# EAGLE design 2016_CanSat_payload_main_final (EAGLE 7.2.0)

## Sheet 1 of 2
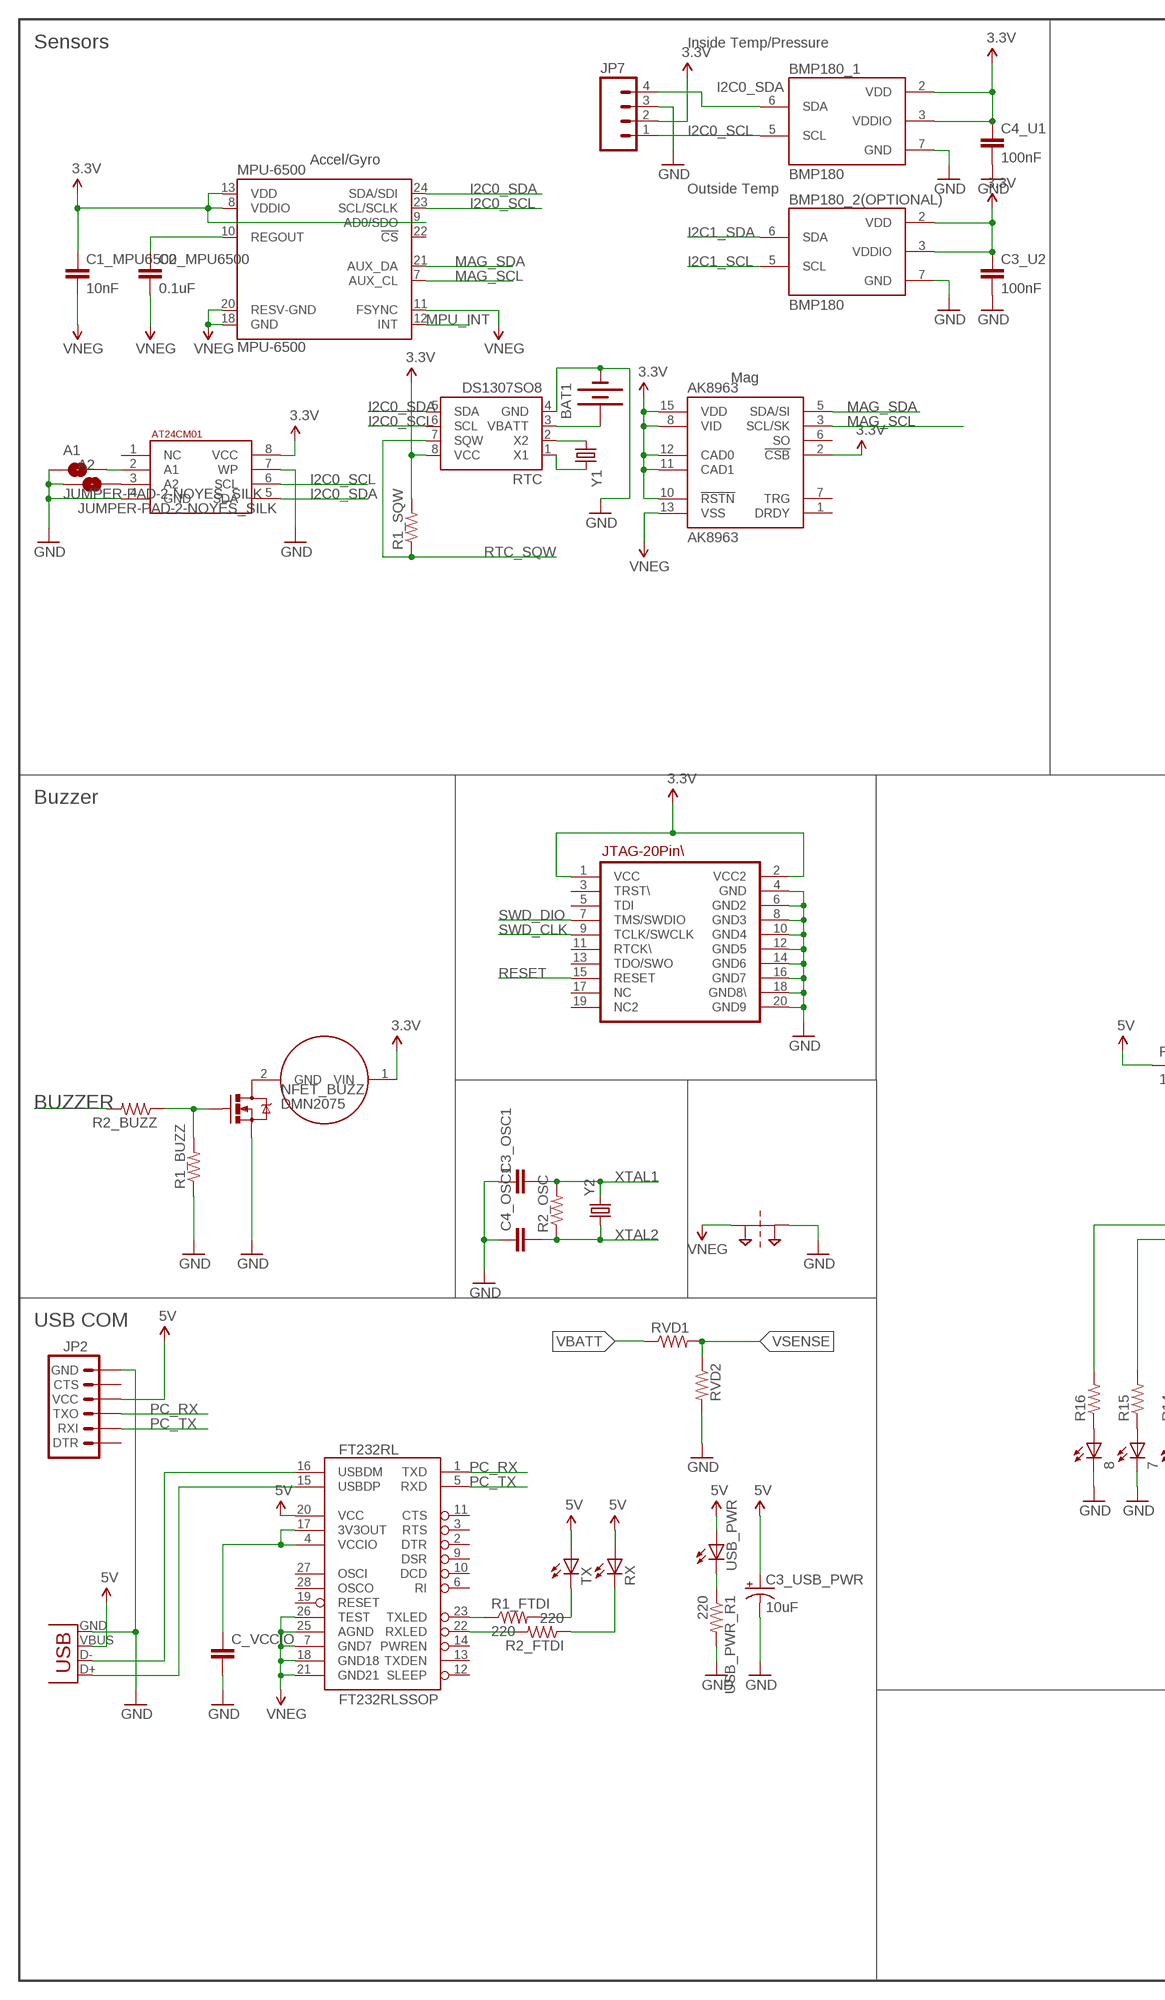
[diagram p0: schematic, sheet 1, part 1 of 2]
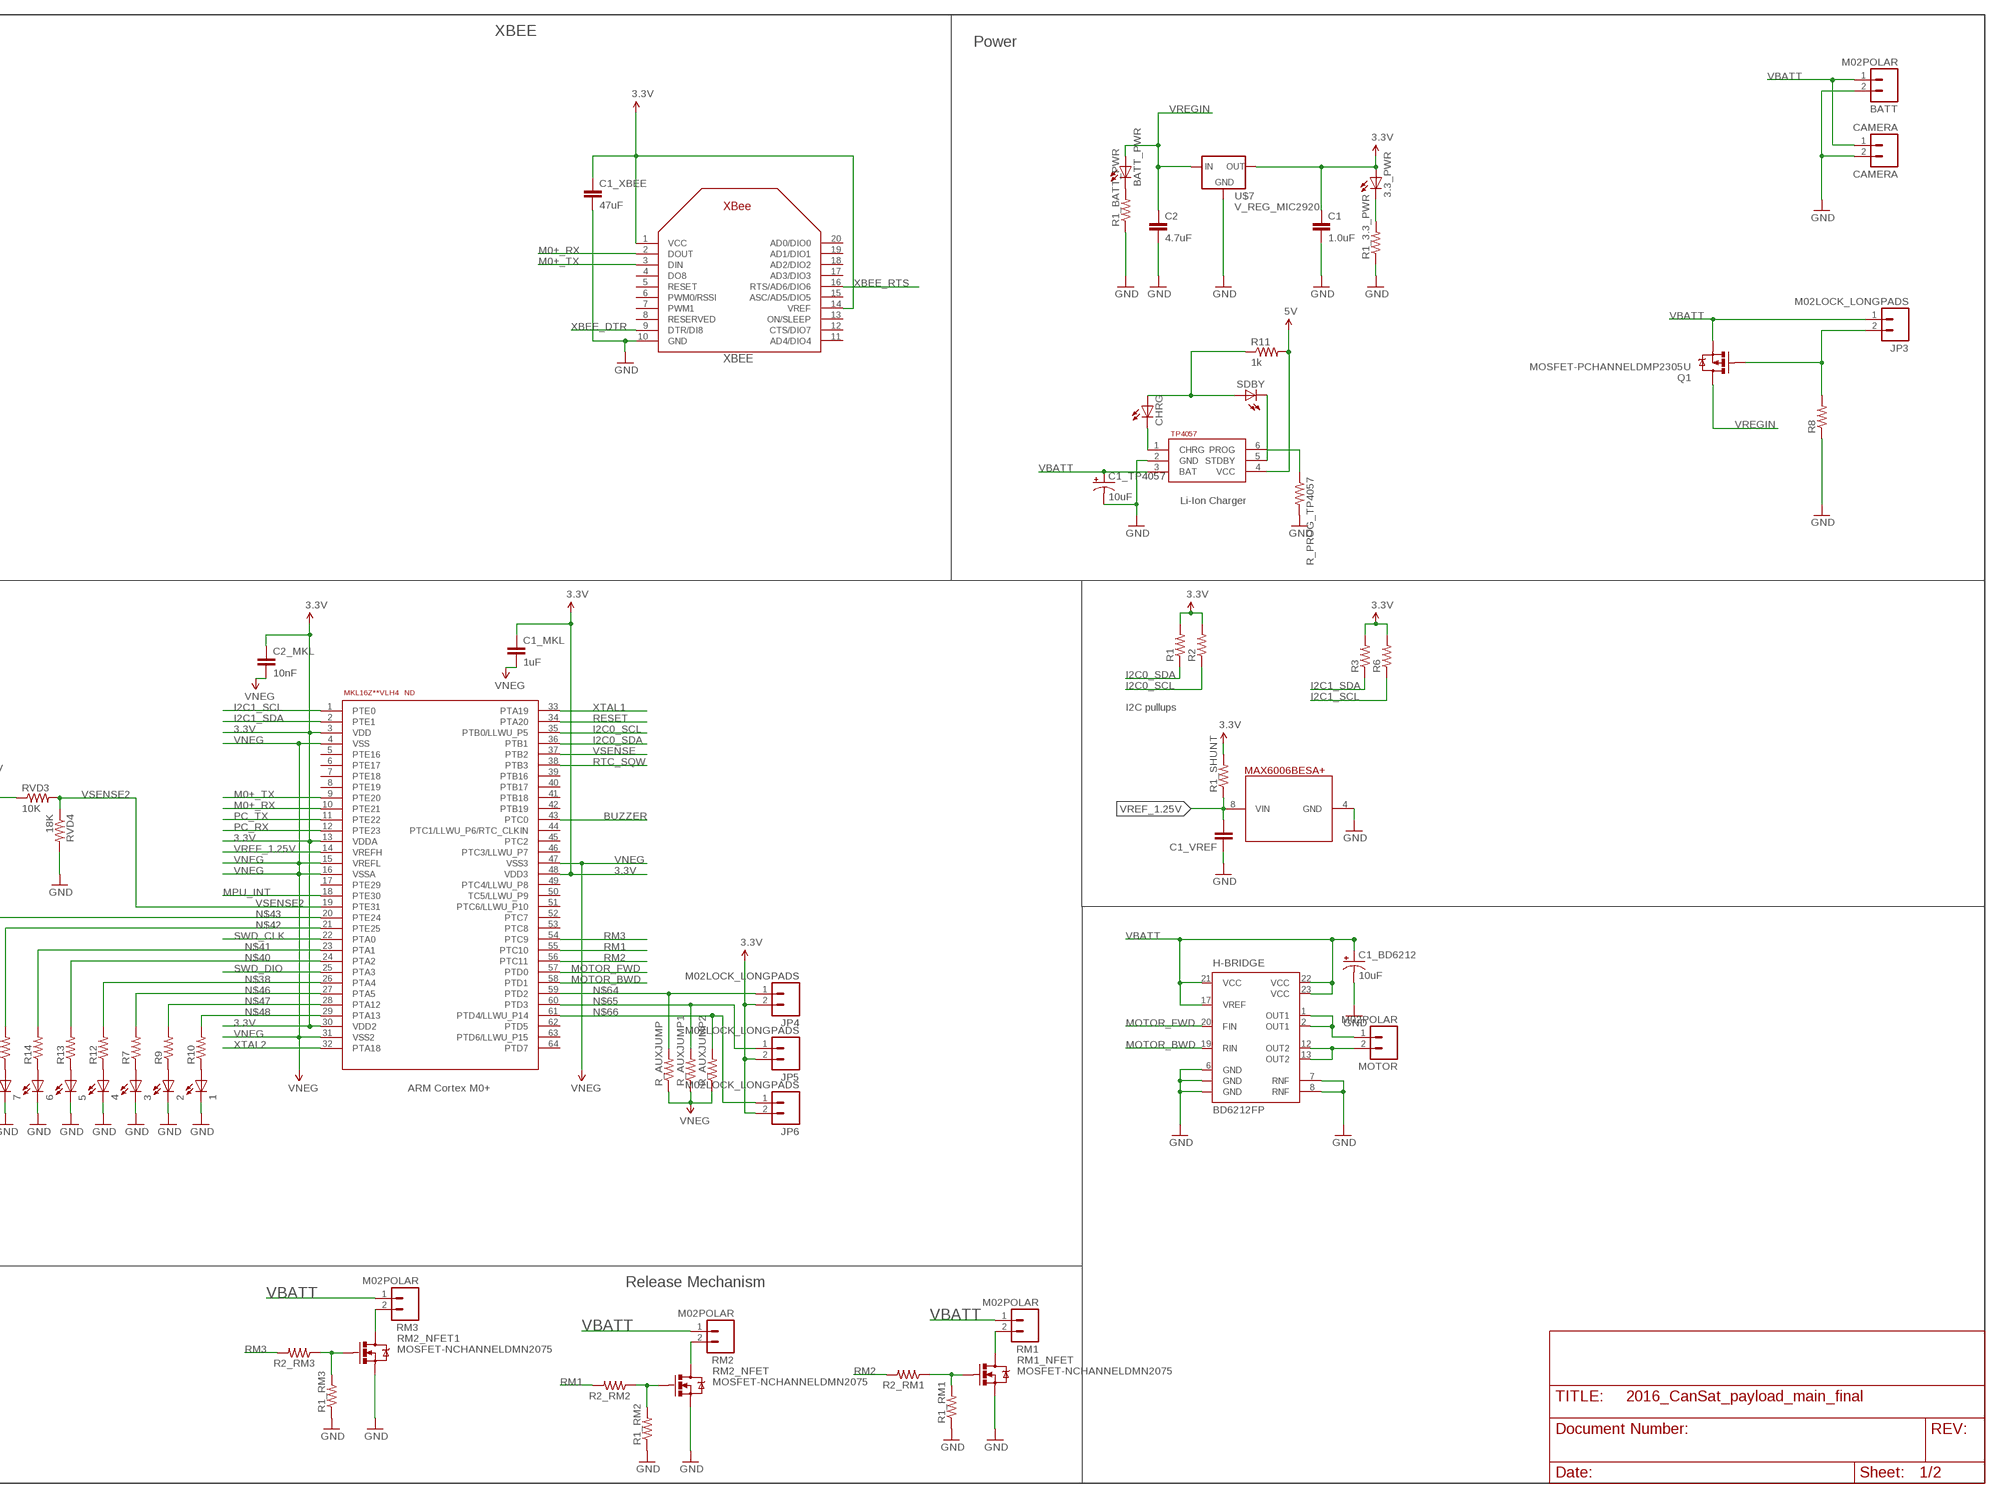
[diagram p1: schematic, sheet 1, part 2 of 2]

### Parts
1  LEDCHIP-LED0603  [CHIP-LED0603]
2  LEDCHIP-LED0603  [CHIP-LED0603]
3  LEDCHIP-LED0603  [CHIP-LED0603]
3.3_PWR  LEDCHIP-LED0603  [CHIP-LED0603]
4  LEDCHIP-LED0603  [CHIP-LED0603]
5  LEDCHIP-LED0603  [CHIP-LED0603]
6  LEDCHIP-LED0603  [CHIP-LED0603]
7  LEDCHIP-LED0603  [CHIP-LED0603]
8  LEDCHIP-LED0603  [CHIP-LED0603]
A1  JUMPER-PAD-2-NOYES_SILK  [PAD-JUMPER-2-NO_YES_SILK]
A2  JUMPER-PAD-2-NOYES_SILK  [PAD-JUMPER-2-NO_YES_SILK]
AK8963  AK8963  [QFN16-HS]
BAT1  BATTERY12MM  [BATTCON_12MM]
BATT  M02POLAR  [MOLEX-1X2]
BATT_PWR  LEDCHIP-LED0603  [CHIP-LED0603]
BMP180_1  BMP180  [BMP180]
BMP180_2(OPTIONAL)  BMP180  [BMP180]
C1  1.0uF  1.0UF-16V-10%(0603)  [0603-CAP]
C1_BD6212  10uF  10UF-16V-10%(TANT)  [EIA3216]
C1_MKL  1uF  CAP0603-CAP  [0603-CAP]
C1_MPU6500  10nF  CAP0603-CAP  [0603-CAP]
C1_TP4057  10uF  10UF-16V-10%(TANT)  [EIA3216]
C1_VREF  CAP0603-CAP  [0603-CAP]
C1_XBEE  47uF  CAP0603-CAP  [0603-CAP]
C2  4.7uF  4.7UF-6.3V-10%(0603)0603  [0603-CAP]
C2_MKL  10nF  CAP0603-CAP  [0603-CAP]
C2_MPU6500  0.1uF  CAP0603-CAP  [0603-CAP]
C3_OSC1  CAP0603-CAP  [0603-CAP]
C3_U2  100nF  CAP0603-CAP  [0603-CAP]
C3_USB_PWR  10uF  10UF-16V-10%(TANT)  [EIA3216]
C4_OSC1  CAP0603-CAP  [0603-CAP]
C4_U1  100nF  CAP0603-CAP  [0603-CAP]
C_VCCIO  CAP0603-CAP  [0603-CAP]
CAMERA  CAMERA  M02POLAR  [MOLEX-1X2]
CHRG  LEDCHIPLED_0603  [CHIPLED_0603]
FT232RL  FT232RLSSOP  [SSOP28DB]
H-BRIDGE  BD6212FP  [HSOP25]
JP1  USBOLD  [USB-MINIB-OLD]
JP2  ARDUINO_SERIAL_PROGRAMLONGPADS  [1X06_LONGPADS]
JP3  M02LOCK_LONGPADS  [1X02_LOCK_LONGPADS]
JP4  M02LOCK_LONGPADS  [1X02_LOCK_LONGPADS]
JP5  M02LOCK_LONGPADS  [1X02_LOCK_LONGPADS]
JP6  M02LOCK_LONGPADS  [1X02_LOCK_LONGPADS]
JP7  M04POLAR  [MOLEX-1X4]
JTAG  JTAG_20PIN  [2X10]
MKL16  MKL16ZVLH4-ND  [TQFP64]
MOTOR  M02POLAR  [MOLEX-1X2]
MPU-6500  MPU-6500  [QFN-24]
NFET_BUZZ  DMN2075  MOSFET-NCHANNELDMN2075  [SOT23]
PT1  2PT_GND_TIE  [2PT_GND_TIE]
Q1  MOSFET-PCHANNELDMP2305U  [SOT23-3]
R1  RESISTOR0603-RES  [0603-RES]
R1_3.3_PWR  RESISTOR0603  [0603-RES]
R1_BATT_PWR  RESISTOR0603  [0603-RES]
R1_BUZZ  RESISTOR0805-RES  [0805]
R1_FTDI  220  RESISTOR0603-RES  [0603-RES]
R1_RM1  RESISTOR0805-RES  [0805]
R1_RM2  RESISTOR0805-RES  [0805]
R1_RM3  RESISTOR0805-RES  [0805]
R1_SHUNT  RESISTOR0805-RES  [0805]
R1_SQW  RESISTOR0603-RES  [0603-RES]
R2  RESISTOR0603-RES  [0603-RES]
R2_BUZZ  RESISTOR0805-RES  [0805]
R2_FTDI  220  RESISTOR0603-RES  [0603-RES]
R2_OSC  RESISTOR0805-RES  [0805]
R2_RM1  RESISTOR0805-RES  [0805]
R2_RM2  RESISTOR0805-RES  [0805]
R2_RM3  RESISTOR0805-RES  [0805]
R3  RESISTOR0603-RES  [0603-RES]
R6  RESISTOR0603-RES  [0603-RES]
R7  RESISTOR0603-RES  [0603-RES]
R8  RESISTOR0603  [0603-RES]
R9  RESISTOR0603-RES  [0603-RES]
R10  RESISTOR0603-RES  [0603-RES]
R11  1k  RESISTOR0603  [0603-RES]
R12  RESISTOR0603-RES  [0603-RES]
R13  RESISTOR0603-RES  [0603-RES]
R14  RESISTOR0603-RES  [0603-RES]
R15  RESISTOR0603-RES  [0603-RES]
R16  RESISTOR0603-RES  [0603-RES]
R_AUXJUMP  RESISTOR0805-RES  [0805]
R_AUXJUMP1  RESISTOR0805-RES  [0805]
R_AUXJUMP2  RESISTOR0805-RES  [0805]
R_PROG_TP4057  RESISTOR0603  [0603-RES]
RM1  M02POLAR  [MOLEX-1X2]
RM1_NFET  MOSFET-NCHANNELDMN2075  [SOT23]
RM2  M02POLAR  [MOLEX-1X2]
RM2_NFET  MOSFET-NCHANNELDMN2075  [SOT23]
RM2_NFET1  MOSFET-NCHANNELDMN2075  [SOT23]
RM3  M02POLAR  [MOLEX-1X2]
RTC  DS1307SO8  [SO08]
RVD1  RESISTOR0805-RES  [0805]
RVD2  RESISTOR0805-RES  [0805]
RVD3  10K  RESISTOR0805-RES  [0805]
RVD4  18K  RESISTOR0805-RES  [0805]
RX  LEDCHIPLED_0603  [CHIPLED_0603]
SDBY  LEDCHIPLED_0603  [CHIPLED_0603]
TX  LEDCHIPLED_0603  [CHIPLED_0603]
U$2  AT24CM01  [SO08]
U$3  TP4057  [SOT23-6]
U$4  AI-1027-TWT-3V-R_BUZZER  [AI-1027-TWT-3V-R_BUZZER]
U$5  MAX6006BESA+  [SO08]
U$7  V_REG_MIC2920  [SOT223]
USB_PWR  LEDCHIPLED_0603  [CHIPLED_0603]
USB_PWR_R1  220  RESISTOR0603-RES  [0603-RES]
XBEE  XBEE  [XBEE]
Y1  CRYSTAL32-SMD  [CRYSTAL-32KHZ-SMD]
Y2  CRYSTAL5X3  [CRYSTAL-SMD-5X3]

### Nets
3.3V [data]: 3.3_PWR.A AK8963.2(!CSB) AK8963.8(VID) AK8963.10(!RSTN) AK8963.11(CAD1) AK8963.12(CAD0) AK8963.15(VDD) BMP180_1.2(VDD) BMP180_1.3(VDDIO) BMP180_2(OPTIONAL).2(VDD) BMP180_2(OPTIONAL).3(VDDIO) C1.1 C1_MKL.1 C1_MPU6500.1 C1_XBEE.1 C2_MKL.1 C3_U2.1 C4_U1.1 JP4.2 JP5.2 JP6.2 JP7.2 JTAG.1(VCC) JTAG.2(VCC2) MKL16.3(VDD) MKL16.13(VDDA) MKL16.30(VDD2) MKL16.48(VDD3) MPU-6500.8(VDDIO) MPU-6500.9(AD0/SDO) MPU-6500.13(VDD) R1.2 R1_SHUNT.2 R1_SQW.2 R2.2 R3.2 R6.2 RTC.8(VCC) U$2.8(VCC) U$4.1(VIN) U$7.3(OUT) XBEE.1(VCC) XBEE.14(VREF)
5V [power2]: C3_USB_PWR.A(+) FT232RL.20(VCC) JP1.VBUS JP2.4(VCC) R11.2 RVD3.1 RX.A TX.A U$3.4(VCC) USB_PWR.A
BUZZER: MKL16.43(PTC0) R2_BUZZ.2
GND [power]: 1.C 2.C 3.C 4.C 5.C 6.C 7.C 8.C A1.1 A2.1 BAT1.GND(-) BATT.2 BMP180_1.7(GND) BMP180_2(OPTIONAL).7(GND) C1.2 C1_BD6212.C(-) C1_TP4057.C(-) C1_VREF.1 C1_XBEE.2 C2.2 C3_OSC1.1 C3_U2.2 C3_USB_PWR.C(-) C4_OSC1.1 C4_U1.2 C_VCCIO.2 CAMERA.2 H-BRIDGE.6(GND) H-BRIDGE.7(RNF) H-BRIDGE.8(RNF) H-BRIDGE.GND@1(GND) H-BRIDGE.GND@2(GND) JP1.GND JP2.6(GND) JP7.3 JTAG.4(GND) JTAG.6(GND2) JTAG.8(GND3) JTAG.10(GND4) JTAG.12(GND5) JTAG.14(GND6) JTAG.16(GND7) JTAG.18(GND8\) JTAG.20(GND9) NFET_BUZZ.2(S) PT1.P$2 R1_3.3_PWR.1 R1_BATT_PWR.1 R1_BUZZ.1 R1_RM1.1 R1_RM2.1 R1_RM3.1 R8.1 R_PROG_TP4057.2 RM1_NFET.2(S) RM2_NFET1.2(S) RM2_NFET.2(S) RTC.4(GND) RVD2.2 RVD4.2 U$2.4(GND) U$2.7(WP) U$3.2(GND) U$5.4(GND) U$7.2(GND) USB_PWR_R1.2 XBEE.10(GND)
I2C0_SCL [data]: BMP180_1.5(SCL) JP7.1 MKL16.35(PTB0/LLWU_P5) MPU-6500.23(SCL/SCLK) R2.1 RTC.6(SCL) U$2.6(SCL)
I2C0_SDA [data]: BMP180_1.6(SDA) JP7.4 MKL16.36(PTB1) MPU-6500.24(SDA/SDI) R1.1 RTC.5(SDA) U$2.5(SDA)
I2C1_SCL: BMP180_2(OPTIONAL).5(SCL) MKL16.1(PTE0) R6.1
I2C1_SDA: BMP180_2(OPTIONAL).6(SDA) MKL16.2(PTE1) R3.1
M0+_RX [data]: MKL16.10(PTE21) XBEE.2(DOUT)
M0+_TX [data]: MKL16.9(PTE20) XBEE.3(DIN)
MAG_SCL [data]: AK8963.3(SCL/SK) MPU-6500.7(AUX_CL)
MAG_SDA [data]: AK8963.5(SDA/SI) MPU-6500.21(AUX_DA)
MOTOR_BWD: H-BRIDGE.19(RIN) MKL16.58(PTD1)
MOTOR_FWD: H-BRIDGE.20(FIN) MKL16.57(PTD0)
MPU_INT: MKL16.18(PTE30) MPU-6500.12(INT)
N$1: 3.A R7.1
N$2: 1.A R10.1
N$3 [data]: FT232RL.16(USBDM) JP1.D-
N$4 [data]: C2_MPU6500.1 MPU-6500.10(REGOUT)
N$5 [data]: FT232RL.15(USBDP) JP1.D+
N$6 [data]: FT232RL.23(TXLED) R1_FTDI.1
N$7 [data]: A2.2 U$2.3(A2)
N$9 [data]: R1_FTDI.2 TX.C
N$10 [data]: FT232RL.22(RXLED) R2_FTDI.2
N$11 [data]: R2_FTDI.1 RX.C
N$12 [data]: USB_PWR.C USB_PWR_R1.1
N$13 [data]: C_VCCIO.1 FT232RL.4(VCCIO) FT232RL.17(3V3OUT)
N$15 [data]: A1.2 U$2.2(A1)
N$17 [data]: JP3.2 Q1.1(G) R8.2
N$18 [data]: 3.3_PWR.C R1_3.3_PWR.2
N$19 [data]: BATT_PWR.C R1_BATT_PWR.2
N$20 [data]: CHRG.A R11.1 SDBY.A
N$21 [data]: CHRG.C U$3.1(CHRG)
N$22 [data]: SDBY.C U$3.5(STDBY)
N$23 [data]: R_PROG_TP4057.1 U$3.6(PROG)
N$24: NFET_BUZZ.1(G) R1_BUZZ.2 R2_BUZZ.1
N$25: 2.A R9.1
N$26: R1_RM1.2 R2_RM1.1 RM1_NFET.1(G)
N$28 [power]: H-BRIDGE.1(OUT1) H-BRIDGE.2(OUT1) MOTOR.1
N$30: NFET_BUZZ.3(D) U$4.2(GND)
N$31: 8.A R16.1
N$32 [power]: RM2.2 RM2_NFET.3(D)
N$33 [power]: H-BRIDGE.12(OUT2) H-BRIDGE.13(OUT2) MOTOR.2
N$34: RTC.2(X2) Y1.X1
N$35: RTC.1(X1) Y1.X2
N$36: BAT1.PWR@1(+) RTC.3(VBATT)
N$38: MKL16.26(PTA4) R12.2
N$39 [power]: RM1.2 RM1_NFET.3(D)
N$40: MKL16.24(PTA2) R13.2
N$41: MKL16.23(PTA1) R14.2
N$42: MKL16.21(PTE25) R15.2
N$43: MKL16.20(PTE24) R16.2
N$44 [power]: RM2_NFET1.3(D) RM3.2
N$46: MKL16.27(PTA5) R7.2
N$47: MKL16.28(PTA12) R9.2
N$48: MKL16.29(PTA13) R10.2
N$49: 4.A R12.1
N$64: JP4.1 MKL16.59(PTD2) R_AUXJUMP.2
N$65: JP5.1 MKL16.60(PTD3) R_AUXJUMP1.2
N$66: JP6.1 MKL16.61(PTD4/LLWU_P14) R_AUXJUMP2.2
N$70: 5.A R13.1
N$72: 6.A R14.1
N$74: 7.A R15.1
PC_RX [data]: FT232RL.1(TXD) JP2.3(TXO) MKL16.12(PTE23)
PC_TX [data]: FT232RL.5(RXD) JP2.2(RXI) MKL16.11(PTE22)
R2_RM1: R1_RM3.2 R2_RM3.1 RM2_NFET1.1(G)
R2_RM2: R1_RM2.2 R2_RM2.1 RM2_NFET.1(G)
RESET [data]: JTAG.15(RESET) MKL16.34(PTA20)
RM1: MKL16.55(PTC10) R2_RM2.2
RM2: MKL16.56(PTC11) R2_RM1.2
RM3: MKL16.54(PTC9) R2_RM3.2
RTC_SQW: MKL16.38(PTB3) R1_SQW.1 RTC.7(SQW)
SWD_CLK [data]: JTAG.9(TCLK/SWCLK) MKL16.22(PTA0)
SWD_DIO [data]: JTAG.7(TMS/SWDIO) MKL16.25(PTA3)
VBATT [power]: BATT.1 C1_BD6212.A(+) C1_TP4057.A(+) CAMERA.1 H-BRIDGE.17(VREF) H-BRIDGE.21(VCC) H-BRIDGE.22(VCC) H-BRIDGE.23(VCC) JP3.1 Q1.2(S) RM1.1 RM2.1 RM3.1 RVD1.1 U$3.3(BAT)
VNEG: AK8963.13(VSS) C1_MKL.2 C1_MPU6500.2 C2_MKL.2 C2_MPU6500.2 FT232RL.7(GND7) FT232RL.18(GND18) FT232RL.21(GND21) FT232RL.25(AGND) FT232RL.26(TEST) MKL16.4(VSS) MKL16.15(VREFL) MKL16.16(VSSA) MKL16.31(VSS2) MKL16.47(VSS3) MPU-6500.11(FSYNC) MPU-6500.18(GND) MPU-6500.20(RESV-GND) PT1.P$1 R_AUXJUMP1.1 R_AUXJUMP2.1 R_AUXJUMP.1
VREF_1.25V: C1_VREF.2 MKL16.14(VREFH) R1_SHUNT.1 U$5.8(VIN)
VREGIN [power]: BATT_PWR.A C2.1 Q1.3(D) U$7.1(IN)
VSENSE: MKL16.37(PTB2) RVD1.2 RVD2.1
VSENSE2: MKL16.19(PTE31) RVD3.2 RVD4.1
XBEE_DTR [data]: XBEE.9(DTR/DI8)
XBEE_RTS [data]: XBEE.16(RTS/AD6/DIO6)
XTAL1 [data]: C3_OSC1.2 MKL16.33(PTA19) R2_OSC.2 Y2.3
XTAL2 [data]: C4_OSC1.2 MKL16.32(PTA18) R2_OSC.1 Y2.1
Unconnected: AK8963.1(DRDY) AK8963.6(SO) AK8963.7(TRG) FT232RL.2(DTR) FT232RL.3(RTS) FT232RL.6(RI) FT232RL.9(DSR) FT232RL.10(DCD) FT232RL.11(CTS) FT232RL.12(SLEEP) FT232RL.13(TXDEN) FT232RL.14(PWREN) FT232RL.19(RESET) FT232RL.27(OSCI) FT232RL.28(OSCO) JP2.1(DTR) JP2.5(CTS) JTAG.3(TRST\) JTAG.5(TDI) JTAG.11(RTCK\) JTAG.13(TDO/SWO) JTAG.17(NC) JTAG.19(NC2) MKL16.5(PTE16) MKL16.6(PTE17) MKL16.7(PTE18) MKL16.8(PTE19) MKL16.17(PTE29) MKL16.39(PTB16) MKL16.40(PTB17) MKL16.41(PTB18) MKL16.42(PTB19) MKL16.44(PTC1/LLWU_P6/RTC_CLKIN) MKL16.45(PTC2) MKL16.46(PTC3/LLWU_P7) MKL16.49(PTC4/LLWU_P8) MKL16.50(TC5/LLWU_P9) MKL16.51(PTC6/LLWU_P10) MKL16.52(PTC7) MKL16.53(PTC8) MKL16.62(PTD5) MKL16.63(PTD6/LLWU_P15) MKL16.64(PTD7) MPU-6500.22(!CS) U$2.1(NC) XBEE.4(DO8) XBEE.5(RESET) XBEE.6(PWM0/RSSI) XBEE.7(PWM1) XBEE.8(RESERVED) XBEE.11(AD4/DIO4) XBEE.12(CTS/DIO7) XBEE.13(ON/SLEEP) XBEE.15(ASC/AD5/DIO5) XBEE.17(AD3/DIO3) XBEE.18(AD2/DIO2) XBEE.19(AD1/DIO1) XBEE.20(AD0/DIO0)

### Notes on the sheet
- Sensors | XBEE
- Inside Temp/Pressure | Power
- Accel/Gyro
- Outside Temp
- Mag
- Li-Ion Charger
- Buzzer
- I2C pullups
- USB COM
- ARM Cortex M0+
- Release Mechanism

## Sheet 2 of 2

## Library data of the parts
1-3 3.3_PWR 4-8 BATT_PWR CHRG RX SDBY TX USB_PWR = adafruit:LED: LED OSRAM: - CHIPLED LG R971, LG N971, LY N971, LG Q971, LY Q971, LO R971, LY R971 LH N974, LH R974 LS Q976, LO Q976, LY Q976 LO Q996 - Hyper CHIPLED LW Q18S LB Q993, LB Q99A, LB R99A - SideLED LS A670, LO A670, LY A670, LG A670, LP A670 LB A673, LV A673, LT A673, LW A673 LH A674 LY A675 LS A676, LA A676, LO A676, LY A676, LW A676 LS A679, LY A679, LG A679 - Hyper Micro SIDELED® LS Y876, LA Y876, LO Y876, LY Y876 LT Y87S - SmartLED LW L88C, LW L88S LB L89C, LB L89S, LG L890 LS L89K, LO L89K, LY L89K LS L896, LA L896, LO L896, LY L896 - TOPLED LS T670, LO T670, LY T670, LG T670, LP T670 LSG T670, LSP T670, LSY T670, LOP T670, LYG T670 LG T671, LOG T671, LSG T671 LB T673, LV T673, LT T673, LW T673 LH T674 LS T676, LA T676, LO T676, LY T676, LB T676, LH T676, LSB T676, LW T676 LB T67C, LV T67C, LT T67C, LS T67K, LO T67K, LY T67K, LW E67C LS E67B, LA E67B, LO E67B, LY E67B, LB E67C, LV E67C, LT E67C LW T67C LS T679, LY T679, LG T679 LS T770, LO T770, LY T770, LG T770, LP T770 LB T773, LV T773, LT T773, LW T773 LH T774 LS E675, LA E675, LY E675, LS T675 LS T776, LA T776, LO T776, LY T776, LB T776 LHGB T686 LT T68C, LB T68C - Hyper Mini TOPLED® LB M676 - Mini TOPLED Santana® LG M470 LS M47K, LO M47K, LY M47K Source: http://www.osram.convergy.de/
A1 A2 = SparkFun-Passives:JUMPER-PAD-2-NO
AK8963 = custom-spave:AK8963: AK8963 A 3-axis electronic compass IC with high sensitive Hall sensor technology
BAT1 = SparkFun-Electromechanical:BATTERY: Battery Holders Various common sizes : AA, AAA, 20mm coin cell and 12mm coin cell. 20MM_4LEGS, BATT-10373
BATT CAMERA JP3-JP6 MOTOR RM1-RM3 = SparkFun-Connectors:M02: Standard 2-pin 0.1" header. Use with - straight break away headers ( PRT-00116) - right angle break away headers (PRT-00553) - swiss pins (PRT-00743) - machine pins (PRT-00117) - female headers (PRT-00115) Molex polarized connector foot print use with: PRT-08233 with associated crimp pins and housings. 2.54_SCREWTERM for use with PRT-10571. 3.5mm Screw Terminal footprints for PRT-08084 5mm Screw Terminal footprints for use with PRT-08433
BMP180_1 BMP180_2(OPTIONAL) = SparkFun-Sensors:BMP180: BOSCH BMP180 DIGITAL BAROMETRIC PRESSURE SENSOR Web page: http://www.bosch-sensortec.com/en/homepage/products_3/environmental_sensors_1/bmp180_1/bmp180 Datasheet: http://ae-bst.resource.bosch.com/media/products/dokumente/bmp180/BST-BMP180-DS000-09.pdf The BMP180 is the function compatible successor of the BMP085, a new generation of high precision digital pressure sensors for consumer applications. The ultra-low power, low voltage electronics of the BMP180 is optimized for use in mobile phones, PDAs, GPS navigation devices and outdoor equipment. With a low altitude noise of merely 0.25m at fast conversion time, the BMP180 offers superior performance. The I2C interface allows for easy system integration with a microcontroller. The BMP180 is based on piezo-resistive technology for EMC robustness, high accuracy and linearity as well as long term stability. Key features: - Temperature measurement included - I2C interface - Fully calibrated - Pb-free, halogen-free and RoHS compliant, - MSL 1 Basic specs: Pressure range: 300 to 1100hPa (+9000m to -500m relating to sea level) Supply voltage: 1.8 to 3.6V (VDD), 1.62V to 3.6V (VDDIO) Package: LGA package with metal lid Small footprint: 3.6mm x 3.8mm Super-flat: 0.93mm height Low power: 5μA at 1 sample / sec. in standard mode Low noise: 0.06hPa (0.5m) in ultra low power mode, 0.02hPa (0.17m) advanced resolution mode Typical applications: - Enhancement of GPS navigation (dead-reckoning, slope detection, etc.) - In- and out-door navigation - Leisure and sports - Weather forecast - Vertical velocity indication (rise/sink speed)
C1 = SparkFun-Capacitors:1.0UF-16V-10%(0603): CAP-00868; PROD_ID: CAP-00868
C1_BD6212 C1_TP4057 C3_USB_PWR = SparkFun-Capacitors:10UF-16V-10%(TANT): CAP-00811 1206/EIA-3216 Tantalum capacitor; PROD_ID: CAP-00811
C1_MKL C1_MPU6500 C1_XBEE C2_MKL C2_MPU6500 C3_U2 C4_U1 C_VCCIO = SparkFun-Capacitors:CAP: Capacitor Standard 0603 ceramic capacitor, and 0.1" leaded capacitor.
C1_VREF C3_OSC1 C4_OSC1 = SparkFun-Passives:CAP: Capacitor Standard 0603 ceramic capacitor, and 0.1" leaded capacitor.
C2 = SparkFun-Capacitors:4.7UF-6.3V-10%(0603): CAP-08280; PROD_ID: CAP-08280
FT232RL = SparkFun-DigitalIC:FT232RL: USB UART FT232RL 4th Generation USB UART (USB <-> Serial) Controller. Spark Fun Electronics SKU : COM-00650 Production SKU IC-00870; PROD_ID: IC-00870
H-BRIDGE = JonathanLukas:BD6212FP
JP1 = SparkFun-Connectors:USB: USB Connectors USB-B-PTH is fully proven SKU : PRT-00139/CONN-08278 USB-miniB is fully proven SKU : PRT-00587 USB-A-PCB is untested. USB-A-H is throughly reviewed, but untested. Spark Fun Electronics SKU : PRT-00437 USB-B-SMT is throughly reviewed, but untested. Needs silkscreen touching up. USB-A-S has not been used/tested USB-MB-H has not been used/tested USB-MICROB has been used. CONN-09505
JP2 = SparkFun-Connectors:ARDUINO_SERIAL_PROGRAM: FTDI connector footprints
JP7 = SparkFun-Connectors:M04: Header 4 Standard 4-pin 0.1" header. Use with straight break away headers (SKU : PRT-00116), right angle break away headers (PRT-00553), swiss pins (PRT-00743), machine pins (PRT-00117), and female headers (PRT-00115). Molex polarized connector foot print use with SKU : PRT-08231 with associated crimp pins and housings. 1MM SMD Version SKU: PRT-10208
JTAG = JonathanLukas:JTAG_20PIN
MKL16 = JonathanLukas:MKL16Z**VLH4-ND
MPU-6500 = custom-spave:MPU-6500: MPU-6500 3-axis gyroscope, 3-axis accelerometer, digital output, qfn24 package
NFET_BUZZ RM1_NFET RM2_NFET RM2_NFET1 = JonathanLukas:MOSFET-NCHANNEL: Common NMOSFET Parts MFG P/N Store ID Prod ID FDD8780 TRANS-09984 SI7820DN TRANS-11055 FDS6630A IC-08089 2N7002PW TRANS-11151 FQP30N06L COM-10213 TRANS-10060 BSS123LT1G TRANS-08345 BSS138 TRANS-00830 BS170 2N7000
PT1 = SparkFun-Passives:2PT_GND_TIE: Package for connecting two ground nets in one place.
Q1 = JonathanLukas:MOSFET-PCHANNEL: Generic PMOSFET IRLML2244 - TRANS-11153 (SOT-23 -20V -4.3A) (1.Gate 2.Source 3.Drain) FQP27P06 - COM-10349 <http://www.sparkfun.com/products/10349> (TO-220 -60V -27A) (1.Gate 2.Source 3.Drain)
R1 R1_FTDI R1_SQW R2 R2_FTDI R3 R6 R7 R9 R10 R12-R16 USB_PWR_R1 = SparkFun-Passives:RESISTOR: Resistor Basic schematic elements and footprints for 0603, 1206, and PTH resistors.
R1_3.3_PWR R1_BATT_PWR R1_BUZZ R1_RM1-R1_RM3 R1_SHUNT R2_BUZZ R2_OSC R2_RM1-R2_RM3 R8 R11 R_AUXJUMP R_AUXJUMP1 R_AUXJUMP2 R_PROG_TP4057 RVD1-RVD4 = SparkFun-Resistors:RESISTOR: Resistor Basic schematic elements and footprints for 0603, 1206, and PTH resistors.
RTC = SparkFun-FreqCtrl:DS1307: I2C real-time clock with battery backup.
U$2 = JonathanLukas:AT24CM01
U$3 = JonathanLukas:TP4057
U$4 = JonathanLukas:AI-1027-TWT-3V-R_BUZZER
U$5 = JonathanLukas:MAX6006BESA+
U$7 = SparkFun-PowerIC:V_REG_MIC2920: MIC2920A (http://www.micrel.com/_PDF/mic2920.pdf) - 400mA output LDO Regulator
XBEE = adafruit:XBEE
Y1 = SparkFun-FreqCtrl:CRYSTAL: Various standard crystals. Proven footprints. Spark Fun Electronics SKU : COM-00534; PROD_ID: XTAL-07894
Y2 = SparkFun-FreqCtrl:CRYSTAL: Various standard crystals. Proven footprints. Spark Fun Electronics SKU : COM-00534

## Net classes
0 default: width 0.203 mm
1 data: width 0.152 mm
2 power: width 0.635 mm, clearance 0.152 mm
3 power2: width 0.381 mm, clearance 0.152 mm

## Board
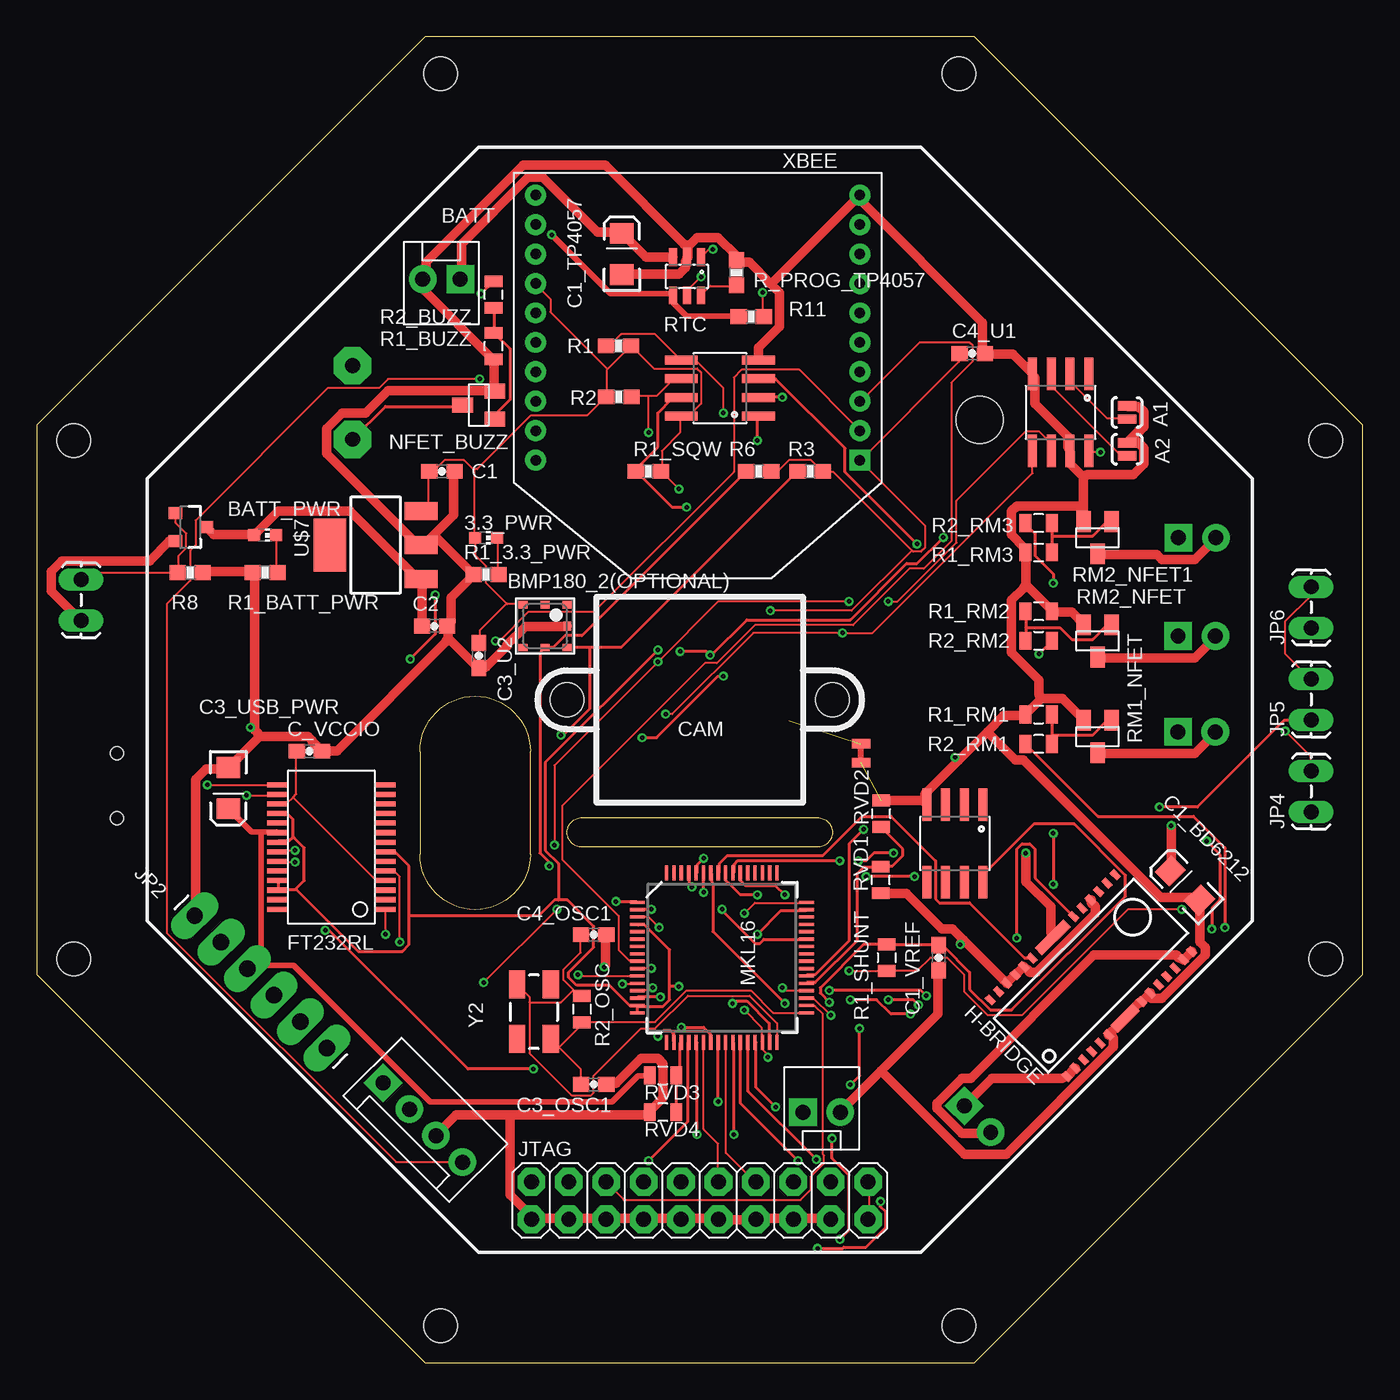
[diagram p2: board, top side]
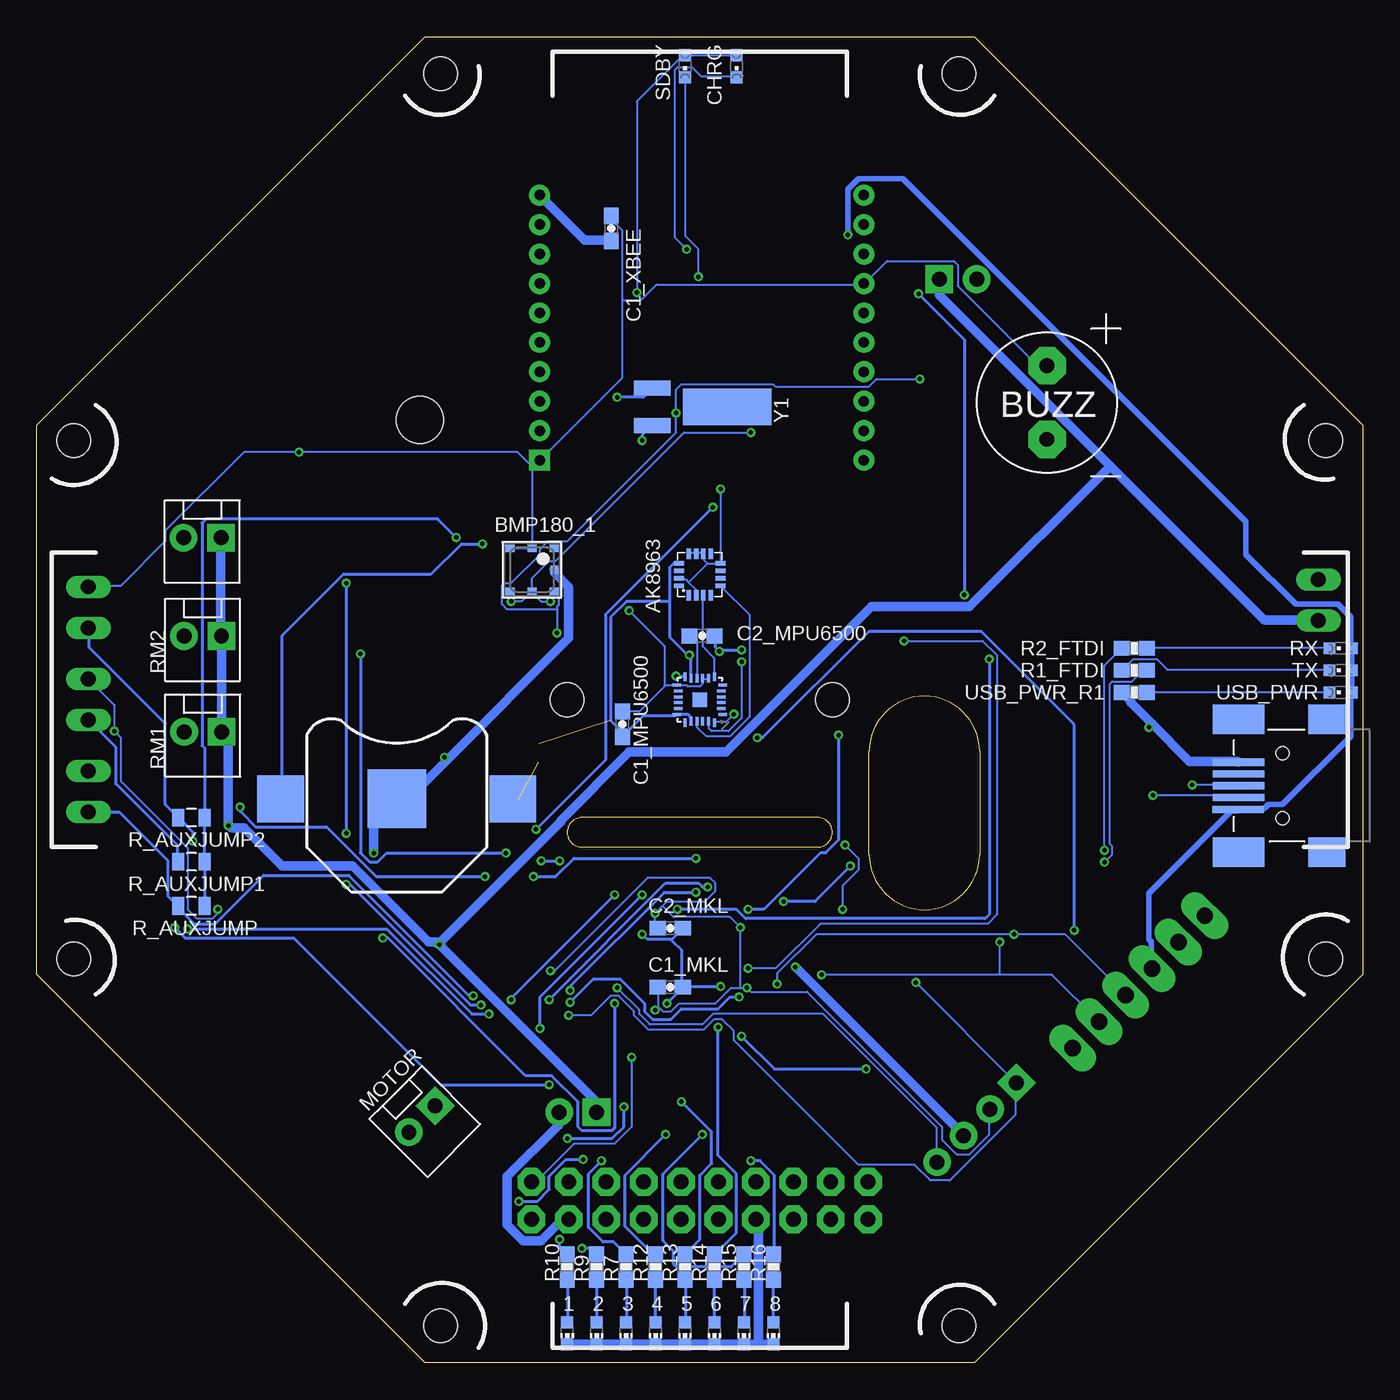
[diagram p3: board, bottom side, seen from below]

Size 90 x 90 mm. Coordinates in mm from the lower left corner, seen from the top.
Outline: 90,26.36 90,63.64 63.64,90 26.36,90 0,63.64 0,26.36 26.36,0 63.64,0 90,26.36
Outline: 37,35 arc-180 37,37 53,37 arc-180 53,35 37,35
Outline: 33.5,34.5 arc-180 26,34.5 26,41.5 arc-180 33.5,41.5 33.5,34.5
Copper layers (1*16): Top 0.035mm / dielectric 1.5mm / Bottom 0.035mm
Design rules "ITEADstudio_DRC": minimum track width 6mil, minimum drill 12mil, track to track 6mil, track to pad 6mil, pad to pad 6mil, via to via 6mil, smd to smd 0mil, copper to edge 10mil, drill to drill 10mil, minimum pad ring 10mil, minimum via ring 6mil, stop-mask expansion 2mil, vias tented up to drill 100mil, thermal gap 10mil
Holes 2.28 mm at 27.4,87.5 62.6,87.5 87.5,62.6 87.5,27.4 62.6,2.5 27.4,2.5 2.5,27.4 2.5,62.6 54,45 36,45
Holes 3.2 mm at 64,64
tRestrict: area 25.5,30.5 to 34,45.5; area -15.5,-16 to 115.5,114
bRestrict: area 25.5,30.5 to 34,45.5; area -15.5,-16 to 115.5,114

### Footprints (pad centres in the part's own frame; a part is rotated, then mirrored left to right if it is on the bottom)
CHIP-LED0603 = smd 0.8 x 0.8: A 0,-0.75; C 0,0.75
PAD-JUMPER-2-NO_YES_SILK = smd 0.635 x 1.27: 1 -0.45,0; 2 0.45,0
QFN16-HS = smd 0.7 x 0.3: 1 -1.413,0.75; 2 -1.413,0.25; 3 -1.413,-0.25; 4 -1.413,-0.75; 9 1.413,-0.75; 10 1.413,-0.25; 11 1.413,0.25; 12 1.413,0.75 | smd 0.3 x 0.7: 5 -0.75,-1.413; 6 -0.25,-1.413; 7 0.25,-1.413; 8 0.75,-1.413; 13 0.75,1.413; 14 0.25,1.413; 15 -0.25,1.413; 16 -0.75,1.413
BATTCON_12MM = smd 3.962 x 3.962: GND 0,0 | smd 3.175 x 3.175: PWR@1 -7.874,0; PWR@2 7.874,0
MOLEX-1X2 = drill 1.016 pad 1.88 square: 1 0,0 | drill 1.016 pad 1.88: 2 2.54,0
BMP180 = smd 0.6 x 0.5: 1 1.5,1.45; 2 0,1.45; 3 -1.5,1.45; 4 -1.5,-1.45; 5 0,-1.45; 6 1.5,-1.45 | smd 0.5 x 0.6: 7 1.5,0
0603-CAP = smd 1.1 x 1: 1 -0.85,0; 2 0.85,0
EIA3216 = smd 1.4 x 1.6: A 1.4,0; C -1.4,0
CHIPLED_0603 = smd 0.8 x 0.8: A 0,-0.75; C 0,0.75
SSOP28DB = smd 0.348 x 1.397: 1 -4.225,-3.656; 2 -3.575,-3.656; 3 -2.925,-3.656; 4 -2.275,-3.656; 5 -1.625,-3.656; 6 -0.975,-3.656; 7 -0.325,-3.656; 8 0.325,-3.656; 9 0.975,-3.656; 10 1.625,-3.656; 11 2.275,-3.656; 12 2.925,-3.656; 13 3.575,-3.656; 14 4.225,-3.656; 15 4.225,3.656; 16 3.575,3.656; 17 2.925,3.656; 18 2.275,3.656; 19 1.625,3.656; 20 0.975,3.656; 21 0.325,3.656; 22 -0.325,3.656; 23 -0.975,3.656; 24 -1.625,3.656; 25 -2.275,3.656; 26 -2.925,3.656; 27 -3.575,3.656; 28 -4.225,3.656
HSOP25 = smd 0.4 x 0.7: 1 -6,-3.675; 2 -5.2,-3.675; 3 -4.4,-3.675; 4 -3.6,-3.675; 5 -2.8,-3.675; 6 -2,-3.675; 7 1.2,-3.675; 8 2,-3.675; 9 2.8,-3.675; 10 3.6,-3.675; 11 4.4,-3.675; 12 5.2,-3.675; 13 6,-3.675; 14 6,3.675; 15 5.2,3.675; 16 4.4,3.675; 17 3.6,3.675; 18 2.8,3.675; 19 2,3.675; 20 -2,3.675; 21 -2.8,3.675; 22 -3.6,3.675; 23 -4.4,3.675; 24 -5.2,3.675; 25 -6,3.675 | smd 2.1 x 0.7: GND@1 -0.4,-3.675 | smd 2.75 x 0.7: GND@2 0,3.675
USB-MINIB-OLD = smd 2.5 x 2: 1 -3,-4.5; 2 -3,4.5 | smd 3.5 x 2: 3 3,-4.5; 4 3,4.5 | smd 3.5 x 0.5: D+ 3,0; D- 3,0.8; GND 3,-1.6; ID 3,-0.8; VBUS 3.01,1.61 | hole 0.9: 0,2.2; 0,-2.2
1X06_LONGPADS = drill 1.118 pad 1.88 long: 1 0,0; 2 2.54,0; 3 5.08,0; 4 7.62,0; 5 10.16,0; 6 12.7,0
1X02_LOCK_LONGPADS = drill 1.016 long: 1 -0.127,0; 2 2.667,0
MOLEX-1X4 = drill 1.016 pad 1.88 square: 1 0,0 | drill 1.016 pad 1.88: 2 2.54,0; 3 5.08,0; 4 7.62,0
2X10 = drill 1.016 pad 1.88 octagon: 1 -11.43,-1.27; 2 -11.43,1.27; 3 -8.89,-1.27; 4 -8.89,1.27; 5 -6.35,-1.27; 6 -6.35,1.27; 7 -3.81,-1.27; 8 -3.81,1.27; 9 -1.27,-1.27; 10 -1.27,1.27; 11 1.27,-1.27; 12 1.27,1.27; 13 3.81,-1.27; 14 3.81,1.27; 15 6.35,-1.27; 16 6.35,1.27; 17 8.89,-1.27; 18 8.89,1.27; 19 11.43,-1.27; 20 11.43,1.27
TQFP64 = smd 0.22 x 1: 1 -3.75,-5.75; 2 -3.25,-5.75; 3 -2.75,-5.75; 4 -2.25,-5.75; 5 -1.75,-5.75; 6 -1.25,-5.75; 7 -0.75,-5.75; 8 -0.25,-5.75; 9 0.25,-5.75; 10 0.75,-5.75; 11 1.25,-5.75; 12 1.75,-5.75; 13 2.25,-5.75; 14 2.75,-5.75; 15 3.25,-5.75; 16 3.75,-5.75; 33 3.75,5.75; 34 3.25,5.75; 35 2.75,5.75; 36 2.25,5.75; 37 1.75,5.75; 38 1.25,5.75; 39 0.75,5.75; 40 0.25,5.75; 41 -0.25,5.75; 42 -0.75,5.75; 43 -1.25,5.75; 44 -1.75,5.75; 45 -2.25,5.75; 46 -2.75,5.75; 47 -3.25,5.75; 48 -3.75,5.75 | smd 1 x 0.22: 17 5.75,-3.75; 18 5.75,-3.25; 19 5.75,-2.75; 20 5.75,-2.25; 21 5.75,-1.75; 22 5.75,-1.25; 23 5.75,-0.75; 24 5.75,-0.25; 25 5.75,0.25; 26 5.75,0.75; 27 5.75,1.25; 28 5.75,1.75; 29 5.75,2.25; 30 5.75,2.75; 31 5.75,3.25; 32 5.75,3.75; 49 -5.75,3.75; 50 -5.75,3.25; 51 -5.75,2.75; 52 -5.75,2.25; 53 -5.75,1.75; 54 -5.75,1.25; 55 -5.75,0.75; 56 -5.75,0.25; 57 -5.75,-0.25; 58 -5.75,-0.75; 59 -5.75,-1.25; 60 -5.75,-1.75; 61 -5.75,-2.25; 62 -5.75,-2.75; 63 -5.75,-3.25; 64 -5.75,-3.75
QFN-24 = smd 0.575 x 0.2: 1 -1.55,1; 2 -1.45,0.6; 3 -1.45,0.2; 4 -1.45,-0.2; 5 -1.45,-0.6; 6 -1.55,-1; 13 1.55,-1; 14 1.45,-0.6; 15 1.45,-0.2; 16 1.45,0.2; 17 1.45,0.6; 18 1.55,1 | smd 0.2 x 0.575: 7 -1,-1.55; 8 -0.6,-1.45; 9 -0.2,-1.45; 10 0.2,-1.45; 11 0.6,-1.45; 12 1,-1.55; 19 1,1.55; 20 0.6,1.45; 21 0.2,1.45; 22 -0.2,1.45; 23 -0.6,1.45; 24 -1,1.55 | smd 1 x 1: TH 0,0
SOT23 = smd 1 x 1.4: 1 -0.95,-1.1; 2 0.95,-1.1; 3 0,1.1
2PT_GND_TIE = smd 1.27 x 0.635: P$1 0,0.635; P$2 0,-0.635
SOT23-3 = smd 0.8 x 0.9: 1 -0.95,-1; 2 0.95,-1; 3 0,1.1
0603-RES = smd 1.1 x 1: 1 -0.85,0; 2 0.85,0
0805 = smd 0.8 x 1.2: 1 -0.9,0; 2 0.9,0
SO08 = smd 0.61 x 2.21: 1 -1.905,-2.616; 2 -0.635,-2.616; 3 0.635,-2.616; 4 1.905,-2.616; 5 1.905,2.616; 6 0.635,2.616; 7 -0.635,2.616; 8 -1.905,2.616
SOT23-6 = smd 0.55 x 1.2: 1 -0.95,-1.3; 2 0,-1.3; 3 0.95,-1.3; 4 0.95,1.3; 5 0,1.3; 6 -0.95,1.3
AI-1027-TWT-3V-R_BUZZER = drill 1 pad 2.54 octagon: 1 0,2.5; 2 0,-2.5
SOT223 = smd 1.219 x 2.235: 1 -2.311,-3.099; 2 0,-3.099; 3 2.311,-3.099 | smd 3.6 x 2.2: 4 0,3.099
XBEE = drill 0.7 pad 1.422 square: 1 -11,5.5 | drill 0.7 pad 1.422: 2 -11,3.5; 3 -11,1.5; 4 -11,-0.5; 5 -11,-2.5; 6 -11,-4.5; 7 -11,-6.5; 8 -11,-8.5; 9 -11,-10.5; 10 -11,-12.5; 11 11,-12.5; 12 11,-10.5; 13 11,-8.5; 14 11,-6.5; 15 11,-4.5; 16 11,-2.5; 17 11,-0.5; 18 11,1.5; 19 11,3.5; 20 11,5.5
CRYSTAL-32KHZ-SMD = smd 2.5 x 6: SHEILD 0,5.08 | smd 1 x 2.5: X1 -1.27,0; X2 1.27,0
CRYSTAL-SMD-5X3 = smd 1.9 x 1.1: 1 -1.85,-1.15; 2 1.85,-1.15; 3 1.85,1.15; 4 -1.85,1.15

### Placement (x,y rotation side)
1  54,2 180 bottom
2  52,2 180 bottom
3  50,2 180 bottom
3.3_PWR  30.5,56 270 top
4  48,2 180 bottom
5  46,2 180 bottom
6  44,2 180 bottom
7  42,2 180 bottom
8  40,2 180 bottom
A1  74,64.5 270 top
A2  74,62 270 top
AK8963  45,53.5 90 bottom
BAT1  65.57,38.27 0 bottom
BATT  28.74,73.55 180 top
BATT_PWR  15.5,56.17 270 top
BMP180_1  56.38,53.83 0 bottom
BMP180_2(OPTIONAL)  34.5,50 0 top
C1  27.5,60.5 0 top
C1_BD6212  77.94,32.39 135 top
C1_MKL  47,25.5 0 bottom
C1_MPU6500  50.25,43.34 270 bottom
C1_TP4057  39.7,75.26 90 top
C1_VREF  61.22,27.49 90 top
C1_XBEE  51,77 270 bottom
C2  27,50 0 top
C2_MKL  47,29.5 0 bottom
C2_MPU6500  44.84,49.33 0 bottom
C3_OSC1  37.8,18.89 180 top
C3_U2  30,48 270 top
C3_USB_PWR  13,39 270 top
C4_OSC1  37.8,29.05 180 top
C4_U1  63.5,68.5 0 top
C_VCCIO  18.5,41.5 0 top
CAMERA  52,17 0 top
CHRG  42.5,88 180 bottom
FT232RL  20,35 90 top
H-BRIDGE  71.56,26.27 45 top
JP1  5.44,39.16 180 bottom
JP2  19.7,21.36 135 top
JP3  3,50.5 90 top
JP4  86.5,37.5 90 top
JP5  86.5,43.75 90 top
JP6  86.5,50 90 top
JP7  23.5,19 315 top
JTAG  45,11 180 top
MKL16  MKL16Z*VLH4-ND  [TQFP64]  46.5,27.5 270 top
MOTOR  62.95,17.44 225 bottom
MPU-6500  45,45 180 bottom
NFET_BUZZ  30,65 90 top
PT1  55.95,41.37 180 top
Q1  10.41,56.72 270 top
R1  39.49,69.02 0 top
R1_3.3_PWR  30.5,53.5 0 top
R1_BATT_PWR  15.5,53.63 0 top
R1_BUZZ  31,69 90 top
R1_FTDI  15.5,47 180 bottom
R1_RM1  68,44 0 top
R1_RM2  68,51 180 top
R1_RM3  68,55 0 top
R1_SHUNT  57.68,27.49 270 top
R1_SQW  41.5,60.5 0 top
R2  39.51,65.56 180 top
R2_BUZZ  31,72.5 90 top
R2_FTDI  15.5,48.5 180 bottom
R2_OSC  37,24 270 top
R2_RM1  68,42 180 top
R2_RM2  68,49 0 top
R2_RM3  68,57 180 top
R3  52.5,60.5 0 top
R6  49,60.5 0 top
R7  50,6.5 90 bottom
R8  10.41,53.63 180 top
R9  52,6.5 90 bottom
R10  54,6.5 90 bottom
R11  48.5,71 180 top
R12  48,6.5 90 bottom
R13  46,6.5 90 bottom
R14  44,6.5 90 bottom
R15  42,6.5 90 bottom
R16  40,6.5 90 bottom
R_AUXJUMP  79.5,31 180 bottom
R_AUXJUMP1  79.5,34 180 bottom
R_AUXJUMP2  79.5,37 180 bottom
R_PROG_TP4057  47.5,74 90 top
RM1  77.46,42.83 180 bottom
RM1_NFET  72,42.5 180 top
RM2  77.47,49.33 180 bottom
RM2_NFET  72,49 180 top
RM2_NFET1  72,56 180 top
RM3  77.5,56 180 bottom
RTC  46.37,66.16 90 top
RVD1  57.28,32.77 90 top
RVD2  57.32,37.27 90 top
RVD3  42.5,19.5 0 top
RVD4  42.5,17 180 top
RX  1.5,48.5 90 bottom
SDBY  46,88 180 bottom
TX  1.5,47 90 bottom
U$2  69.5,64.5 180 top
U$3  44.13,73.74 180 top
U$4  21.43,65.18 0 bottom
U$5  62.32,35.24 180 top
U$7  23,55.5 90 top
USB_PWR  1.5,45.5 90 bottom
USB_PWR_R1  15.5,45.5 180 bottom
XBEE  44.87,66.76 180 top
Y1  48.22,64.89 270 bottom
Y2  33.75,23.82 270 top

### Tracks (layer width: path | path; a pad name or v marks a point on that pad's centre or on a via)
3.3V  (via drill 0.3)
  Top 0.152: v48.02,30.51 48.73,31.22 52.2,31.22 MKL16.48 | v55.13,26.6 57.62,26.6 R1_SHUNT.2 57.71,26.6 59.76,26.6 60.65,27.49 61.8,27.49 62.96,26.33 62.96,25.18 64.56,23.57 66.87,23.57 74.07,30.78 v77.72,30.78 | JTAG.2 56.47,9.8 56.47,12.2 JTAG.1 | v41.8,25.44 41.62,25.26 40.82,25.26 MKL16.13 | v48.02,23.93 49.18,22.77 49.18,21.8 MKL16.30 49.27,21.71 49.27,21.26 49.62,20.91 v49.62,20.73 | v42.24,29.53 41.53,30.24 40.82,30.24 MKL16.3 | U$7.3 26.15,57.89 26.6,58.34 26.6,60.47 C1.1 26.69,60.56 26.95,60.56 27.66,61.27 29,61.27 29.66,60.6 | BMP180_2(OPTIONAL).2 34.42,51.49 33.09,51.49 BMP180_2(OPTIONAL).3 33,51.49 31.93,51.49 31.89,51.53 | 31.89,51.53 30.51,52.91 30.51,54.07 29.8,54.78 29.8,55.94 3.3_PWR.A 29.71,56.02 29.71,60.56 29.66,60.6 | 31.89,51.53 30.06,49.71 30.06,48.91 C3_U2.1 | v43.58,59.31 42.42,60.47 R1_SQW.2 42.42,60.56 42.42,61.89 43.67,63.14 43.67,64.2 RTC.8 43.76,64.29 44.29,64.29 45.09,65.09 45.09,67.22 44.82,67.49 41.89,67.49 40.38,69 R1.2 40.29,69 38.73,67.45 | 38.73,67.45 38.69,67.4 38.69,65.62 R2.2 38.6,65.54 37.36,64.29 33.53,64.29 29.89,60.65 29.71,60.65 29.66,60.6 | 38.73,67.45 34.87,71.31 34.87,72.2 33.89,73.18 XBEE.14 | v84.74,42.87 86.43,41.18 86.43,40.2 JP4.2 | JP6.2 86.43,52.64 86.43,52.02 84.74,50.33 84.74,48.11 86.43,46.42 JP5.2 | R6.2 49.89,60.56 50.33,60.56 51.05,61.27 52.56,61.27 53.27,60.56 R3.2 53.36,60.47 54.07,60.47 59.4,55.13 | U$2.8 71.49,61.8 v72.2,61.8 | C4_U1.1 62.6,68.47 62.6,67.94 55.94,61.27 XBEE.1 55.94,61.18 60.29,56.82 60.29,55.31 60.02,55.05 59.49,55.05 59.4,55.13 | v49.8,51.05 55.31,51.05 59.4,55.13
  Bottom 0.152: C2_MKL.1 47.93,29.53 48.02,29.62 v48.02,30.51 47.53,31 | v55.13,26.6 54.87,26.6 48.56,32.91 44.29,32.91 43.93,32.55 43.93,32.02 44.64,31.31 47.22,31.31 47.53,31 | 42.24,25.44 42.87,25.44 43.93,24.38 46.42,24.38 46.96,23.84 47.49,23.84 47.8,24.15 | 42.24,25.44 v41.8,25.44 41.53,25.18 37.71,25.18 28.55,16.02 28.55,15.13 27.58,14.15 26.69,14.15 25.35,15.48 25.35,17.17 JP7.2 | 47.8,24.15 47.84,24.2 47.84,25.44 C1_MKL.1 | 47.8,24.15 v48.02,23.93 | 42.24,25.44 v42.24,29.53 42.95,30.24 46.78,30.24 47.53,31 | v49.62,20.73 49.62,16.02 50.78,14.86 53.53,14.86 56.11,12.28 56.38,12.28 JTAG.1 | 45.76,52.96 45.98,53.18 46.33,53.18 AK8963.15 | 45.76,52.96 45.27,52.47 45.27,52.11 AK8963.2 | 44.47,54.25 43.67,54.25 AK8963.8 43.58,54.34 v43.58,59.31 | 44.47,54.25 44.73,54.51 44.73,54.87 AK8963.10 44.82,54.96 45.18,54.96 AK8963.11 45.27,54.96 45.71,54.96 AK8963.12 | 44.47,54.25 45.76,52.96 | U$4.1 21.44,67.76 22.15,67.76 27.49,73.09 27.49,74.52 27.75,74.78 32.29,74.78 33.8,73.27 XBEE.14 33.89,73.18 47.93,73.18 49,72.11 50.24,72.11 | JP5.2 86.43,46.33 84.74,44.64 v84.74,42.87 84.29,42.42 84.29,39.49 79.76,34.95 79.76,30.78 79.14,30.15 78.07,30.15 77.72,30.51 v77.72,30.78 | MPU-6500.8 44.47,46.42 44.73,46.42 MPU-6500.9 44.82,46.42 44.82,46.07 45,45.89 45.8,45.89 45.89,45.98 46.51,45.98 MPU-6500.13 46.6,45.98 47.31,45.98 47.36,45.93 | 47.36,45.93 49.09,44.2 C1_MPU6500.1 | BMP180_1.3 57.8,55.31 56.47,55.31 BMP180_1.2 56.38,55.31 56.38,60.73 55.94,61.18 XBEE.1 | 50.24,72.11 50.24,66.87 55.85,61.27 XBEE.1 | 50.24,72.11 50.24,76.83 50.96,77.54 50.96,77.8 C1_XBEE.1
  Bottom 0.152: XBEE.1 56.38,60.82 57.36,61.8 v72.2,61.8 75.94,61.8 81.27,56.47 81.27,55.76 84.29,52.73 86.43,52.73 JP6.2 | v49.8,51.05 47.4,48.65 47.4,45.98 47.36,45.93
5V  (via drill 0.3)
  Top 0.381: 15.22,36.02 14.6,36.02 13.09,37.53 C3_USB_PWR.A | 15.22,36.02 16.29,36.02 FT232RL.20 | RVD3.1 41.53,19.49 40.82,19.49 39.04,17.71 26.69,17.71 17.44,26.95 14.51,26.95 14.33,26.78 JP2.4 15.22,27.13 15.22,36.02 | R11.2 47.58,71.05 44.11,71.05 43.22,71.94 43.22,72.38 U$3.4 43.04,72.56 38.95,72.56 v34.95,76.56
  Bottom 0.381: v34.95,76.56 34.95,79.67 34.24,80.38 31.22,80.38 7.93,57.09 7.93,54.87 4.55,51.49 1.71,51.49 0.82,50.6 0.82,48.65 RX.A 0.73,48.47 0.73,47.13 TX.A 0.73,46.96 0.73,45.53 USB_PWR.A 0.82,45.36 0.82,42.51 5.44,37.89 6.42,37.89 6.68,37.62 8.37,37.62 JP1.VBUS 8.55,37.44 8.91,37.44 14.51,31.84 14.51,28.73 14.33,28.55 14.33,26.78 JP2.4
BUZZER  (via drill 0.3)
  Top 0.203: v46.51,30.78 46.51,30.69 48.73,28.46 49.09,28.46 49.36,28.73 52.2,28.73 MKL16.43 | v25.35,47.76 27.04,49.45 v27.04,52.11 | v30.15,72.56 30.95,73.36 R2_BUZZ.2
  Bottom 0.203: v46.51,30.78 42.51,30.78 41.89,30.15 25.62,30.15 25.35,30.42 v25.35,47.76 | v27.04,52.11 27.04,69.45 v30.15,72.56
GND  (via drill 0.3)  (1 unrouted)
  Top 0.635: R8.1 11.31,53.71 14.6,53.71 R1_BATT_PWR.1 14.77,53.36 14.77,43.13 | 15.13,42.51 18.42,42.51 18.69,42.24 18.69,42.16 19.31,41.53 C_VCCIO.2 19.66,41.53 20.38,41.53 27.75,48.91 27.93,49.18 | 15.13,42.51 13.09,40.47 C3_USB_PWR.C 12.73,40.29 11.48,40.29 10.77,39.58 10.77,30.42 JP2.6 | 14.77,43.13 14.77,42.95 14.95,42.78 15.13,42.51 | v14.51,43.13 14.77,43.13 | BMP180_2(OPTIONAL).7 35.93,49.98 33.18,49.98 31.93,48.73 31.93,48.65 30.51,47.22 30.06,47.22 C3_U2.2 29.8,47.31 27.93,49.18 | 27.93,49.18 27.93,49.98 C2.2 28.11,50.24 28.11,51.93 29.44,53.27 R1_3.3_PWR.1 29.62,53.53 27.13,56.02 U$7.2 | C1.2 28.29,60.47 28.29,57.53 26.33,55.58 26.15,55.58 U$7.2 | U$7.2 25.8,55.58 19.66,61.71 19.66,63.4 20.73,64.47 22.33,64.47 23.84,65.98 30.78,65.98 NFET_BUZZ.2 31.04,65.98 31.04,68.03 R1_BUZZ.1 30.78,68.29 26.24,72.83 26.24,73.54 BATT.2 26.42,73.8 26.42,74.69 33,81.27 38.6,81.27 43.93,75.94 44.2,75.76 | C3_OSC1.1 38.69,18.95 39.31,18.95 41,20.64 42.16,20.64 42.51,20.29 42.51,17.97 41.62,17.09 RVD4.2 41.35,16.82 32.11,16.82 | v38.51,26.86 38.6,26.95 38.6,29 C4_OSC1.1 | 32.11,16.82 28.46,16.82 27.13,15.48 JP7.3 | 57.31,19.8 54.6,17.09 CAMERA.2 | 57.31,19.8 61.18,23.66 61.18,26.6 C1_VREF.1 | JTAG.4 53.89,9.8 51.67,9.8 JTAG.6 51.31,9.8 49.09,9.8 JTAG.8 48.73,9.71 46.6,9.71 JTAG.10 46.24,9.8 44.02,9.8 JTAG.12 43.67,9.8 41.44,9.8 JTAG.14 41.18,9.8 38.95,9.8 JTAG.16 38.6,9.8 36.38,9.8 JTAG.18 36.11,9.8 33.62,9.8 JTAG.20 33.44,10.06 32.11,11.4 32.11,16.82 | 69,28.91 H-BRIDGE.GND@2 68.83,29.18 68.83,30.95 67.14,32.64 v67.14,34.6 | 44.2,75.76 44.82,76.38 46.24,76.38 47.49,75.14 47.49,74.87 R_PROG_TP4057.2 47.76,74.69 48.38,74.69 49.84,73.23
  Top 0.635: 44.2,75.76 44.2,75.05 U$3.2 44.02,74.78 44.02,74.34 43.58,73.89 39.76,73.89 C1_TP4057.C | 49.84,73.23 50.42,72.65 50.42,70.34 49,68.91 49,68.11 RTC.4 | 49.84,73.23 55.85,79.23 XBEE.10 55.94,78.87 64.2,70.6 64.2,68.74 C4_U1.2 64.38,68.47 66.25,68.47 67.58,67.14 U$2.4 67.76,66.87 67.76,65.09 69.98,62.87 69.98,62.16 U$2.7 70.16,61.8 70.16,61 71.05,60.11 | A1.1 74.07,64.91 74.78,64.91 75.14,64.56 75.14,63.49 74.87,63.22 74.78,63.22 74.07,62.51 A2.1 74.6,62.6 75.14,62.07 75.14,61 74.43,60.29 71.31,60.29 71.05,60.11 | 71.05,60.11 71.05,58.16 | 71.05,58.16 71.05,57.18 RM2_NFET1.2 | 72.83,22.24 H-BRIDGE.6 | 72.83,22.24 73,22.51 73.8,23.31 H-BRIDGE.GND@1 | 75.05,24.55 75.49,25 H-BRIDGE.8 75.67,24.73 76.38,24.73 79.31,27.66 79.31,28.2 78.96,28.55 78.96,31.4 C1_BD6212.C 78.69,31.58 76.29,31.58 66.96,40.91 66.42,40.91 64.51,42.82 | 75.05,24.55 H-BRIDGE.7 | 75.05,24.55 74.78,24.38 73.98,23.57 H-BRIDGE.GND@1 | 73.89,23.4 H-BRIDGE.GND@1 | RVD2.2 57.36,38.16 60.11,38.16 60.38,37.89 U$5.4 60.29,38.42 60.29,38.6 62.56,40.87 | 68.2,45.09 67.14,44.02 R1_RM1.1 66.78,43.93 65.62,43.93 64.51,42.82 | 68.2,45.09 69.62,45.09 71.05,43.67 RM1_NFET.2 | RM2_NFET.2 71.05,50.16 70.25,50.96 68.91,50.96 R1_RM2.1 68.74,51.22 67.14,52.82 | 67.14,52.82 67.14,54.96 R1_RM3.1 67.05,55.31 66.16,56.2 66.16,57.8 66.51,58.16 71.05,58.16 | 68.2,45.09 68.03,45.36 68.03,46.33 66.16,48.2 66.16,51.76 66.96,52.56 67.14,52.82 | 64.51,42.82 62.56,40.87 | v62.34,41.09 62.56,40.87 | 57.31,19.8 62.96,14.15 65.8,14.15 73.09,21.44 73.09,22.06 72.83,22.24
  Bottom 0.635: 14.29,43.35 11.75,40.82 8.46,40.82 JP1.GND | 14.29,43.35 15.75,44.82 15.75,44.91 16.29,45.45 USB_PWR_R1.2 | v14.51,43.13 14.29,43.35 | v38.51,26.86 27.13,15.48 JP7.3 | 41,1.26 41.98,1.26 7.C 42.24,1.26 43.93,1.26 6.C 44.29,1.26 45.98,1.26 5.C 46.24,1.26 47.93,1.26 4.C 48.29,1.26 49.98,1.26 3.C 50.24,1.26 51.93,1.26 2.C 52.29,1.26 53.98,1.26 1.C | 41,1.26 40.02,1.26 8.C | 41,1.26 41,9.53 41.18,9.71 JTAG.14 | CAMERA.2 54.6,17 54.6,16.11 58.07,12.64 58.07,9.35 57,8.28 55.76,8.28 54.34,9.71 53.89,9.71 JTAG.4 | 62.16,40.91 64.74,38.33 65.54,38.33 BAT1.GND 65.8,38.07 67.14,36.73 v67.14,34.6 | 62.16,40.91 53.89,49.18 53.89,52.64 54.87,53.62 54.87,53.8 BMP180_1.7 | C1_XBEE.2 51.05,76.2 52.82,76.2 55.85,79.23 XBEE.10 | v62.34,41.09 62.16,40.91
I2C0_SCL  (via drill 0.3)
  Top 0.152: v53.89,23.57 52.73,24.73 52.29,24.73 MKL16.35 | 41.53,65.62 42.07,65.62 43.22,66.78 43.67,66.78 RTC.6 | 41.53,65.62 40.38,65.62 R2.1 | v55.13,51.67 46.24,51.67 v42.16,47.58 35.13,40.55 v35.13,35.13 | v57.8,51.67 58.42,51.67 62.42,55.67 62.42,58.51 67.14,63.22 68.03,63.22 68.83,62.42 68.83,61.89 U$2.6 | v41.53,63.14 41.53,65.62 | v35.31,30.78 v30.33,25.8
  Bottom 0.152: v53.89,23.57 52.38,23.57 51.05,24.91 50.51,24.91 49.45,23.84 49.45,23.57 48.47,22.6 44.73,22.6 44.02,23.31 43.49,23.31 42.69,22.51 42.69,21.89 34.24,13.44 30.42,13.44 29.35,12.37 28.02,12.37 23.57,16.82 23.57,18.95 JP7.1 23.57,19.04 v30.33,25.8 | v42.16,47.58 42.16,43.76 43.04,42.87 44.2,42.87 44.38,43.04 44.38,43.49 MPU-6500.23 | v55.13,51.67 55.76,51.67 56.38,52.29 BMP180_1.5 | v57.8,51.67 57.09,51.67 56.47,52.29 BMP180_1.5 | v41.53,63.14 46.07,63.14 54.78,54.42 55.22,54.42 56.38,53.27 BMP180_1.5 | v35.31,30.78 35.31,32.38 34.24,33.44 34.24,34.24 v35.13,35.13
I2C0_SDA  (via drill 0.3)
  Top 0.152: v50.6,25.44 50.78,25.26 52.2,25.26 MKL16.36 | R1.1 38.69,69.09 38.95,69.09 39.67,69.8 41.98,69.8 43.67,68.11 RTC.5 43.76,68.03 44.73,68.03 46.6,66.16 v46.6,64.47 | v42.69,44.02 43.13,44.02 48.65,49.53 v54.69,49.53 56.73,49.53 67.58,60.38 67.58,61.8 U$2.5 | v30.06,66.78 23.84,66.78 23.22,66.16 19.75,66.16 10.77,57.18 10.77,55.49 10.42,55.13 10.42,53.09 8.82,51.49 8.82,29.18 24.38,13.62 28.82,13.62 JP7.4
  Bottom 0.152: v50.6,25.44 49.09,23.93 49.09,23.66 48.38,22.95 44.82,22.95 44.11,23.66 36.64,23.66 28.91,15.93 28.91,13.62 JP7.4 | v42.69,44.02 43.22,43.49 43.93,43.49 MPU-6500.24 | 54.69,51.13 54.69,51.31 54.6,51.4 54.6,52.02 54.87,52.29 BMP180_1.6 | 54.69,51.13 v54.69,49.53 | 54.69,51.13 58.07,51.13 58.42,51.49 58.42,52.73 58.25,52.91 57.8,52.91 55.85,54.87 55.85,55.22 55.31,55.76 53.98,55.76 46.6,63.14 v46.6,64.47 46.6,66.07 46.24,66.42 40.02,66.42 39.84,66.25 33.53,66.25 33,66.78 v30.06,66.78
I2C1_SCL  (via drill 0.3)
  Top 0.203: R6.1 48.11,60.47 37,49.36 35.84,49.36 35.04,48.56 BMP180_2(OPTIONAL).5 34.42,48.47 34.15,48.2 34.15,34.6 34.78,33.98 v34.78,33.71 | v39.31,31.31 40.73,31.31 MKL16.1
  Bottom 0.203: v39.31,31.31 37.18,31.31 v34.78,33.71
I2C1_SDA  (via drill 0.3)
  Top 0.203: 37.53,48.56 39.67,48.56 51.58,60.47 R3.1 | 37.53,48.56 36.02,48.56 BMP180_2(OPTIONAL).6 | v41.71,30.78 40.82,30.78 MKL16.2 | v35.58,42.6 35.75,42.6 37.53,44.38 37.53,48.56
  Bottom 0.203: v41.71,30.78 40.64,30.78 36.82,34.6 36.47,34.6 35.58,35.49 v35.58,42.6
M0+_RX  (via drill 0.3)
  Top 0.152: v41.71,26.78 40.82,26.78 MKL16.10 | v31.13,49 31.4,49 33.35,50.96 37.8,50.96 47.31,60.47 47.31,66.87 47.84,67.4 51.76,67.4 55.85,63.31 XBEE.2
  Bottom 0.152: v41.71,26.78 39.84,26.78 36.82,29.8 25.44,29.8 24.82,30.42 24.82,48.02 25.8,49 v31.13,49
M0+_TX
  Top 0.152: MKL16.9 40.73,27.31 40.2,27.31 39.49,28.02 39.49,30.33 35.66,34.15 35.66,37.8 45.36,47.49 46.16,47.49 48.73,50.07 55.4,50.07 59.22,53.89 60.2,53.89 62.07,55.76 62.07,66.51 63.49,67.94 63.49,69.09 63.31,69.27 59.94,69.27 55.94,65.27 XBEE.3
MAG_SCL
  Bottom 0.152: MPU-6500.7 44.02,46.6 44.02,47.84 44.82,48.65 44.82,52.02 AK8963.3
MAG_SDA
  Bottom 0.152: MPU-6500.21 45.18,43.49 45.18,43.13 44.55,42.51 42.95,42.51 41.62,43.84 41.62,50.78 43.58,52.73 AK8963.5
MOTOR_BWD  (via drill 0.3)
  Top 0.203: v66.51,28.82 66.51,34.87 66.87,35.22 67.4,35.22 67.76,34.87 67.76,32.91 70.34,30.33 H-BRIDGE.19 | v50.78,24.38 45.89,29.27 45.89,32.55 45.8,32.64 45.8,33.18 MKL16.58
  Bottom 0.203: v66.51,28.82 66.16,28.82 56.82,19.49 55.05,19.49 53.27,17.71 53.27,16.02 53,15.75 50.96,15.75 50.78,15.93 v50.78,24.38
MOTOR_FWD
  Top 0.203: H-BRIDGE.20 67.49,27.49 67.05,27.49 63.31,31.22 61.27,31.22 61,31.49 61,34.06 57.98,37.09 56.02,37.09 53.36,34.42 46.87,34.42 46.33,33.89 46.33,33.27 MKL16.57
MPU_INT  (via drill 0.3)
  Top 0.203: v46.6,46.6 46.24,46.6 42.07,42.42 v41.09,42.42 | v19.57,29.35 19.84,29.35 29.27,19.93 v33.71,19.93 | v42.16,22.15 42.51,22.51 43.04,22.51 43.22,22.33 43.22,21.8 MKL16.18
  Bottom 0.203: v46.6,46.6 46.07,46.6 MPU-6500.12 | v41.09,42.42 40.73,42.42 33.53,49.62 25.89,49.62 19.57,43.31 v19.57,29.35 | v33.71,19.93 39.93,19.93 v42.16,22.15
N$1
  Bottom 0.203: 3.A 49.98,2.77 49.98,5.62 R7.1
N$2
  Bottom 0.203: 1.A 53.98,2.77 53.98,5.62 R10.1
N$3  (via drill 0.3)
  Top 0.152: v14.24,38.51 16.29,38.51 FT232RL.16
  Bottom 0.152: v14.24,38.51 8.55,38.51 8.46,38.42 JP1.D-
N$4
  Bottom 0.152: MPU-6500.10 45.18,46.51 45.18,48.82 45.62,49.27 C2_MPU6500.1
N$5  (via drill 0.3)
  Top 0.152: v11.57,39.22 16.29,39.22 FT232RL.15
  Bottom 0.152: v11.57,39.22 8.46,39.22 JP1.D+
N$6  (via drill 0.3)
  Top 0.152: v17.53,33.98 16.37,33.98 FT232RL.23
  Bottom 0.152: v17.53,33.98 17,34.51 17,35.04 17.17,35.22 17.17,46.07 17,46.24 15.66,46.24 14.95,46.96 14.68,46.96 R1_FTDI.1
N$7
  Top 0.152: A2.2 73.98,61.62 73.54,61.62 68.91,66.25 68.91,67.05 U$2.3
N$9
  Bottom 0.152: TX.C 2.33,47.05 13.26,47.05 13.97,47.76 15.57,47.76 16.29,47.05 R1_FTDI.2
N$10  (via drill 0.3)
  Top 0.152: v17.53,34.78 16.46,34.78 16.37,34.69 FT232RL.22
  Bottom 0.152: v17.53,34.78 17.53,47.31 16.37,48.47 R2_FTDI.2
N$11
  Bottom 0.152: RX.C 2.33,48.56 14.6,48.56 R2_FTDI.1
N$12
  Bottom 0.152: USB_PWR.C 2.33,45.53 14.6,45.53 USB_PWR_R1.1
N$13
  Top 0.152: 17.4,38.38 17,37.98 16.37,37.98 FT232RL.17 | 17.4,38.38 17.62,38.6 17.62,41.44 C_VCCIO.1 | 17.4,38.38 23.04,32.73 23.57,32.73 FT232RL.4
N$15
  Top 0.152: A1.2 73.98,64.11 72.65,64.11 70.16,66.6 70.16,67.05 U$2.2
N$17
  Top 0.152: Q1.1 9.44,57.62 9.44,57 10.15,56.29 10.15,55.31 9.62,54.78 9.62,53.71 R8.2 9.53,53.62 3.48,53.62 3.04,53.18 JP3.2
N$18
  Top 0.152: 3.3_PWR.C 31.31,55.94 31.31,53.53 R1_3.3_PWR.2
N$19
  Top 0.152: BATT_PWR.C 16.29,56.11 16.29,53.71 R1_BATT_PWR.2
N$20  (via drill 0.3)
  Top 0.152: v49.27,72.65 49.27,71.05 R11.1
  Bottom 0.152: CHRG.A 42.51,88.74 45.98,88.74 SDBY.A 46.07,88.83 49.27,85.63 v49.27,72.65
N$21  (via drill 0.3)
  Top 0.152: v45.89,75.58 45.62,75.58 U$3.1
  Bottom 0.152: v45.89,75.58 46.69,76.38 46.69,87.76 46.51,87.94 45.53,87.94 44.91,87.32 42.51,87.32 CHRG.C
N$22  (via drill 0.3)
  Top 0.152: v45.09,73.72 44.2,72.83 44.2,72.47 U$3.5
  Bottom 0.152: v45.09,73.72 45.09,75.58 45.98,76.47 45.98,87.23 SDBY.C
N$23
  Top 0.152: R_PROG_TP4057.1 47.49,73.09 45.71,73.09 45.09,72.47 U$3.6
N$24
  Top 0.203: R2_BUZZ.1 31.04,71.58 31.04,69.98 R1_BUZZ.2 31.04,69.89 32.11,68.83 32.11,65.36 31.13,64.38 31.13,64.11 NFET_BUZZ.1
N$25
  Bottom 0.203: 2.A 52.02,2.77 52.02,5.62 R9.1
N$26
  Top 0.203: R1_RM1.2 68.91,43.93 68.91,42.07 R2_RM1.1 69,42.6 71.67,42.6 72.65,43.58 72.91,43.58 RM1_NFET.1
N$28
  Top 0.635: H-BRIDGE.2 70.42,19.93 69.98,19.49 H-BRIDGE.1 69.62,19.31 64.83,19.31 MOTOR.1
N$30
  Top 0.203: NFET_BUZZ.3 28.82,64.91 23.66,64.91 21.44,62.69 U$4.2
N$31
  Bottom 0.203: 8.A 40.02,2.77 40.02,5.62 R16.1
N$32
  Top 0.635: RM2_NFET.3 72.03,47.84 78.6,47.84 80.03,49.27 RM2.2
N$33
  Top 0.635: H-BRIDGE.13 78.34,27.84 77.89,27.4 H-BRIDGE.12 77.54,27.49 77.36,27.66 71.76,27.66 63.4,19.31 62.78,19.31 61.09,17.62 61.09,17.26 62.78,15.57 64.74,15.57 MOTOR.2
N$34  (via drill 0.3)
  Top 0.203: v50.6,65.54 49,65.54 RTC.2
  Bottom 0.203: v50.6,65.54 48.82,65.54 48.29,66.07 Y1.X1
N$35  (via drill 0.3)
  Top 0.203: v48.91,62.6 48.91,64.2 RTC.1
  Bottom 0.203: v48.91,62.6 48.91,62.96 48.29,63.58 Y1.X2
N$36  (via drill 0.3)
  Top 0.203: v59.76,55.58 54.87,60.47 54.87,62.07 50.16,66.78 RTC.3
  Bottom 0.203: v59.76,55.58 61.18,55.58 63.22,53.53 69.18,53.53 73.36,49.36 73.36,38.33 BAT1.PWR@1
N$38  (via drill 0.3)
  Top 0.203: v47.31,15.48 47.31,21.71 MKL16.26
  Bottom 0.203: v47.31,15.48 50.07,12.73 50.07,9.26 48.2,7.4 48.02,7.4 R12.2
N$39
  Top 0.635: RM1_NFET.3 72.03,41.35 78.6,41.35 80.03,42.78 RM1.2
N$40  (via drill 0.3)
  Top 0.203: v46.24,17.71 46.24,21.71 MKL16.24
  Bottom 0.203: v46.24,17.71 44.2,15.66 44.2,13.53 45,12.73 45,8.37 45.98,7.4 R13.2
N$41  (via drill 0.3)
  Top 0.203: v43.76,22.77 45.27,22.77 45.71,22.33 45.71,21.8 MKL16.23
  Bottom 0.203: v43.76,22.77 43.76,14.06 42.51,12.82 42.51,8.82 43.93,7.4 R14.2
N$42  (via drill 0.3)
  Top 0.203: v44.82,15.48 44.82,21.71 MKL16.21
  Bottom 0.203: v44.82,15.48 47.49,12.82 47.49,8.28 46.78,7.57 46.78,6.68 46.6,6.51 42.87,6.51 42.07,7.31 R15.2
N$43  (via drill 0.3)
  Top 0.203: v41.53,13.71 44.2,16.37 44.2,21.71 MKL16.20
  Bottom 0.203: v41.53,13.71 40.91,13.71 39.93,12.73 39.93,7.4 R16.2
N$44
  Top 0.635: RM2_NFET1.3 72.03,54.87 76.03,54.87 76.38,54.51 78.6,54.51 80.03,55.94 RM3.2
N$46  (via drill 0.3)
  Top 0.203: v51.67,13.71 47.76,17.62 47.76,21.71 MKL16.27
  Bottom 0.203: v51.67,13.71 52.56,12.82 52.56,9.17 51.58,8.2 50.87,8.2 50.07,7.4 R7.2
N$47  (via drill 0.3)
  Top 0.203: v52.91,13.8 48.29,18.42 48.29,21.71 MKL16.28 | v57.27,10.95 57.27,10.6 57.62,10.24 57.62,9.17 56.29,7.84 54.78,7.84 54.69,7.75 v53,7.75
  Bottom 0.203: v52.91,13.8 54.07,13.8 55.22,12.64 55.22,11.75 56.02,10.95 v57.27,10.95 | v53,7.75 52.38,7.75 52.02,7.4 R9.2
N$48  (via drill 0.3)
  Top 0.203: v50.16,17.35 48.82,18.69 48.82,21.71 MKL16.29 | v53.98,15.22 53.98,13.89 55.13,12.73 55.13,8.99 v54.51,8.37
  Bottom 0.203: v50.16,17.35 50.16,16.02 50.96,15.22 v53.98,15.22 | v54.51,8.37 54.51,7.84 54.07,7.4 R10.2
N$49
  Bottom 0.203: 4.A 48.02,2.77 48.02,5.62 R12.1
N$64  (via drill 0.3)
  Top 0.203: v45.27,31.93 45.27,33.18 MKL16.59 | v53.8,25.26 60.02,25.26 v60.38,24.91
  Bottom 0.203: v45.27,31.93 47.4,31.93 53.8,25.53 v53.8,25.26 | v60.38,24.91 60.65,24.91 68.83,33.09 74.6,33.09 77.89,29.8 79.31,29.8 80.47,30.95 R_AUXJUMP.2 80.47,31.04 81.09,31.66 81.09,34.06 84.38,37.36 86.43,37.36 JP4.1
N$65  (via drill 0.3)
  Top 0.203: v45.27,34.24 44.82,33.8 44.82,33.27 MKL16.60 | v59.58,33 v56.29,33 | v76.2,37.71 78.78,37.71 84.65,43.58 86.43,43.58 JP5.1
  Bottom 0.203: v45.27,34.24 53.53,34.24 54.78,33 v56.29,33 | v59.58,33 66.96,33 70.34,36.38 75.14,36.38 76.2,37.44 v76.2,37.71 | R_AUXJUMP1.2 80.47,34.06 80.47,35.13 84.65,39.31 84.65,41.8 86.43,43.58 JP5.1
N$66  (via drill 0.3)
  Top 0.203: v44.47,32.29 44.29,32.47 44.29,33.18 MKL16.61 | v55.22,24.64 57,24.64 57.98,23.66 v59.31,23.66 | v79.76,29.44 79.76,30.87 80.29,31.4 80.29,34.51 v79.4,35.4
  Bottom 0.203: v44.47,32.29 44.82,32.29 45.09,32.55 47.31,32.55 v55.22,24.64 | v59.31,23.66 60.47,23.66 66.25,29.44 v79.76,29.44 | v79.4,35.4 79.4,36.02 80.38,37 R_AUXJUMP2.2 80.47,37.09 81.27,37.89 81.27,43.4 86.43,48.56 86.43,49.8 JP6.1
N$70
  Bottom 0.203: 5.A 45.98,2.77 45.98,5.62 R13.1
N$72
  Bottom 0.203: 6.A 44.02,2.77 44.02,5.62 R14.1
N$74
  Bottom 0.203: 7.A 41.98,2.77 41.98,5.62 R15.1
PC_RX  (via drill 0.3)
  Top 0.152: v39.76,25.71 40.73,25.71 MKL16.12 | v23.66,29.09 23.66,30.69 FT232RL.1
  Bottom 0.152: v39.76,25.71 39.76,26.42 37.09,29.09 v23.66,29.09 20.2,29.09 16.11,25 JP2.3
PC_TX  (via drill 0.3)
  Top 0.152: v36.73,26.33 36.82,26.24 40.73,26.24 MKL16.11 | v24.64,28.55 24.64,33 24.29,33.35 23.66,33.35 FT232RL.5
  Bottom 0.152: 24.64,26.33 21.09,26.33 17.97,23.22 JP2.2 | 24.64,26.33 v36.73,26.33 | 24.64,26.33 v24.64,28.55
R2_RM1
  Top 0.203: 68.91,56.11 68.91,56.91 R2_RM3.1 | 68.91,56.11 68.91,55.05 R1_RM3.2 | 68.91,56.11 71.67,56.11 72.65,57.09 72.91,57.09 RM2_NFET1.1
R2_RM2
  Top 0.203: 67.14,49.89 67.14,50.96 R1_RM2.2 | 67.14,49.89 67.14,49 R2_RM2.1 | 67.14,49.89 69.45,49.89 70.25,49.09 71.67,49.09 72.65,50.07 72.91,50.07 RM2_NFET.1
RESET
  Top 0.152: MKL16.34 52.29,24.2 52.82,24.2 53.36,23.66 53.36,14.15 53.45,14.06 53.45,13.53 52.56,12.64 52.56,11.75 51.84,11.04 39.84,11.04 38.69,12.2 JTAG.15
RM1  (via drill 0.3)
  Top 0.203: v54.51,34.06 47.58,34.06 47.31,33.8 47.31,33.27 MKL16.55 | v55.76,34.06 56.29,34.06 56.82,34.6 v58.16,34.6 | v68.03,48.11 68.83,48.91 R2_RM2.2
  Bottom 0.203: v55.76,34.06 v54.51,34.06 | v58.16,34.6 66.25,34.6 66.87,33.98 67.4,33.98 68.03,34.6 v68.03,48.11
RM2  (via drill 0.3)
  Top 0.203: v48.91,31.75 47.76,31.75 46.78,32.73 46.78,33.18 MKL16.56 | v55.85,22.69 55.85,19.49 v55.22,18.86 | v80.65,29.53 80.65,34.95 78.52,37.09 72.03,37.09 67.14,41.98 R2_RM1.2
  Bottom 0.203: v48.91,31.75 55.85,24.82 v55.85,22.69 | v55.22,18.86 62.6,18.86 72.56,28.82 79.94,28.82 v80.65,29.53
RM3  (via drill 0.3)
  Top 0.203: v50.78,31.75 50.16,32.38 48.11,32.38 47.76,32.73 47.76,33.18 MKL16.54 | v57.8,24.64 59.49,24.64 v59.85,24.29 | v69,35.93 v69,32.47 | v69,52.91 69,53.53 67.76,54.78 67.76,56.29 67.14,56.91 R2_RM3.2
  Bottom 0.203: v50.78,31.75 57.8,24.73 v57.8,24.64 | v59.85,24.29 60.56,24.29 68.74,32.47 v69,32.47 | v69,52.91 v69,35.93
RTC_SQW  (via drill 0.3)
  Top 0.203: v56.11,36.2 55.13,35.22 55.13,28.64 52.82,26.33 52.29,26.33 MKL16.38 | v44.11,58.07 43.13,58.07 40.73,60.47 R1_SQW.1 40.73,60.56 40.73,60.73 42.16,62.16 42.16,64.47 43.13,65.45 43.67,65.45 RTC.7
  Bottom 0.203: v56.11,36.2 51.4,40.91 51.4,50.78 v44.11,58.07
SWD_CLK
  Top 0.152: MKL16.22 45.27,21.71 45.27,15.84 46.24,14.86 46.24,12.28 JTAG.9
SWD_DIO
  Top 0.152: MKL16.25 46.78,21.71 46.78,14.24 48.73,12.28 JTAG.7
VBATT  (via drill 0.3)
  Top 0.635: v77,36.47 77,33.44 C1_BD6212.A | H-BRIDGE.17 71.58,31.4 71.58,31.22 71.85,30.95 71.85,30.51 67.85,26.51 67.4,26.51 67.22,26.69 H-BRIDGE.21 66.96,26.86 66.6,26.51 H-BRIDGE.22 66.34,26.24 65.89,25.8 H-BRIDGE.23 65.62,25.98 62.91,28.69 | 62.91,28.69 62.16,29.44 61.45,29.44 59.05,31.84 57.36,31.84 RVD1.1 | v62.69,28.38 62.69,28.46 62.91,28.69 | Q1.2 9.35,55.76 8.99,55.76 7.66,54.42 1.71,54.42 0.99,53.71 0.99,52.38 2.95,50.42 JP3.1 | U$3.3 43.13,75.05 41.35,75.05 39.76,76.65 C1_TP4057.A 39.4,76.74 38.07,76.74 34.33,80.47 33.35,80.47 28.82,75.94 28.82,73.63 BATT.1
  Bottom 0.635: RM3.1 77.54,55.94 77.54,49.62 RM2.1 77.45,49.27 77.45,43.13 RM1.1 77.45,42.78 77,42.33 v77,36.47 76.74,36.29 75.94,36.29 73.36,33.71 68.56,33.71 63.4,28.55 62.96,28.55 v62.69,28.38 | v62.69,28.38 52.02,17.71 52.02,17.09 CAMERA.1 | 17.13,60.87 28.73,72.47 28.73,73.54 BATT.1 | 17.13,60.87 6.68,50.42 3.04,50.42 JP3.1 | 17.13,60.87 26.69,51.31 33.35,51.31 43.22,41.44 49.8,41.44 54.42,36.82 54.42,36.73 62.51,28.64 v62.69,28.38
VNEG  (via drill 0.3)  (1 unrouted)
  Top 0.203: 17.35,35.66 17.09,35.4 16.37,35.4 FT232RL.21 | 17.35,35.66 17.35,36.91 17,37.27 16.37,37.27 FT232RL.18 | FT232RL.25 16.37,32.64 16.37,32.11 FT232RL.26 16.46,32.11 17.62,32.11 | 25.26,30.33 25.26,28.38 24.82,27.93 21.8,27.93 17.62,32.11 | 25.26,30.33 25.26,33.71 24.38,34.6 23.66,34.6 FT232RL.7 | 17.35,35.66 17.44,35.66 18.15,34.95 18.15,32.73 17.62,32.2 17.62,32.11 | MKL16.16 40.73,23.75 40.73,24.2 MKL16.15 | 42.95,25.53 42.95,24.64 42.51,24.2 40.82,24.2 MKL16.15 | 42.95,25.53 42.95,28.02 41.27,29.71 40.82,29.71 MKL16.4 | v47.22,24.38 47.4,24.55 48.2,24.55 49.71,23.04 49.71,21.8 MKL16.31 | v48.91,29.09 50.51,30.69 52.2,30.69 MKL16.47 | v43.58,25.53 42.95,25.53 | 25.26,30.33 34.06,30.33 35.13,31.4 35.4,31.4 | 35.4,31.4 36.02,31.4 37.8,29.62 37.8,28.2 36.11,26.51 36.11,26.15 36.64,25.62 38.87,25.62 40.29,24.2 40.64,24.2 MKL16.15 | v43.67,48.29 45.45,48.29 v45.71,48.02 45.8,48.02 48.2,50.42 55.22,50.42 59.05,54.25 59.76,54.25 v61.53,56.02 | 35.4,31.4 35.4,33.89 34.51,34.78 34.51,40.73 v42.16,48.38
  Bottom 0.203: v47.22,24.38 46.16,25.44 C1_MKL.2 | v48.91,29.09 48.56,28.73 46.87,28.73 | 46.87,28.73 46.16,29.44 C2_MKL.2 | C1_MKL.2 46.24,25.53 46.24,28.02 46.87,28.64 46.87,28.73 | v43.58,25.53 46.07,25.53 C1_MKL.2 | R_AUXJUMP.1 78.6,31.04 78.6,33.98 R_AUXJUMP1.1 78.6,34.06 R_AUXJUMP2.1 78.6,37.09 78.6,41.71 78.78,41.89 78.78,57 78.52,57.27 62.78,57.27 v61.53,56.02 | MPU-6500.20 45.62,43.58 45.62,43.84 45.8,44.02 46.51,44.02 MPU-6500.18 46.6,43.93 48.82,43.93 50.24,42.51 C1_MPU6500.2 50.16,42.69 51.05,43.58 51.05,50.6 49.98,51.67 47.05,51.67 | 45.76,47.98 47.05,49.27 47.05,51.67 | 45.76,47.98 45.62,47.84 45.62,46.51 MPU-6500.11 | 47.05,51.67 47.05,53.98 46.78,54.25 46.42,54.25 AK8963.13 | C2_MPU6500.2 43.93,49.27 43.93,48.56 v43.67,48.29 43.67,48.38 v42.16,48.38 | v45.71,48.02 45.76,47.98
VREF_1.25V  (via drill 0.3)
  Top 0.203: v42.33,24.82 40.82,24.82 MKL16.14 | v53.8,24.46 53.18,25.09 53.18,25.44 56.11,28.38 57.62,28.38 R1_SHUNT.1 57.71,28.38 61.18,28.38 C1_VREF.2 61.27,28.29 61.53,28.29 63.31,26.51 63.31,25.35 64.74,23.93 66.16,23.93 73.89,31.66 73.89,33.09 70.42,36.55 67.67,36.55 64.29,33.18 64.29,32.64 U$5.8
  Bottom 0.203: v42.33,24.82 42.95,24.82 43.76,24.02 46.24,24.02 46.96,23.31 48.2,23.31 48.73,23.84 48.73,24.38 50.42,26.06 52.2,26.06 v53.8,24.46
VREGIN
  Top 0.635: Q1.3 11.57,56.65 12.02,56.2 14.68,56.2 BATT_PWR.A 14.95,56.38 16.37,57.8 21.26,57.8 25.8,53.27 U$7.1 26.15,53.18 26.15,50.07 C2.1
VSENSE
  Top 0.203: MKL16.37 52.29,25.8 52.82,25.8 55.67,28.64 55.67,33.18 56.11,33.62 57.27,33.62 RVD1.2 57.36,33.71 58.07,33.71 58.78,34.42 58.78,34.87 57.36,36.29 RVD2.1
VSENSE2
  Top 0.203: MKL16.19 43.67,21.71 43.67,19.75 43.49,19.57 RVD3.2 43.4,19.49 43.4,17.09 RVD4.1
XTAL1
  Top 0.152: 35.44,21.4 34.95,21.89 Y2.3 | 35.44,21.4 36.91,19.93 36.91,18.95 C3_OSC1.2 | MKL16.33 52.2,23.75 49.98,23.75 48.47,25.26 44.11,25.26 41.98,23.13 37.09,23.13 R2_OSC.2 37.09,23.04 35.44,21.4
XTAL2
  Top 0.152: 36.42,25.31 36.82,24.91 R2_OSC.1 | 36.42,25.31 35.75,25.98 35.75,26.69 36.91,27.84 36.91,29 C4_OSC1.2 | 33.44,24.46 33.44,24.82 32.64,25.62 Y2.1 | 33.44,24.46 33.44,21 36.29,18.15 37.62,18.15 37.8,18.33 37.8,19.49 41,22.69 41.98,22.69 44.2,24.91 48.38,24.91 50.24,23.04 50.24,21.8 MKL16.32 | 36.42,25.31 35.58,24.46 33.44,24.46

### Text on the board
tNames: CAM